# Altium project OpenRex_V1I1.PrjPcb (part 3 of 13)

## Sheet [10] - CPU - GPIO, PWM, LEDS, BUTTONS.SchDoc
size A2; DocumentNumber: 10; SheetNumber: 10; SheetTotal: 31
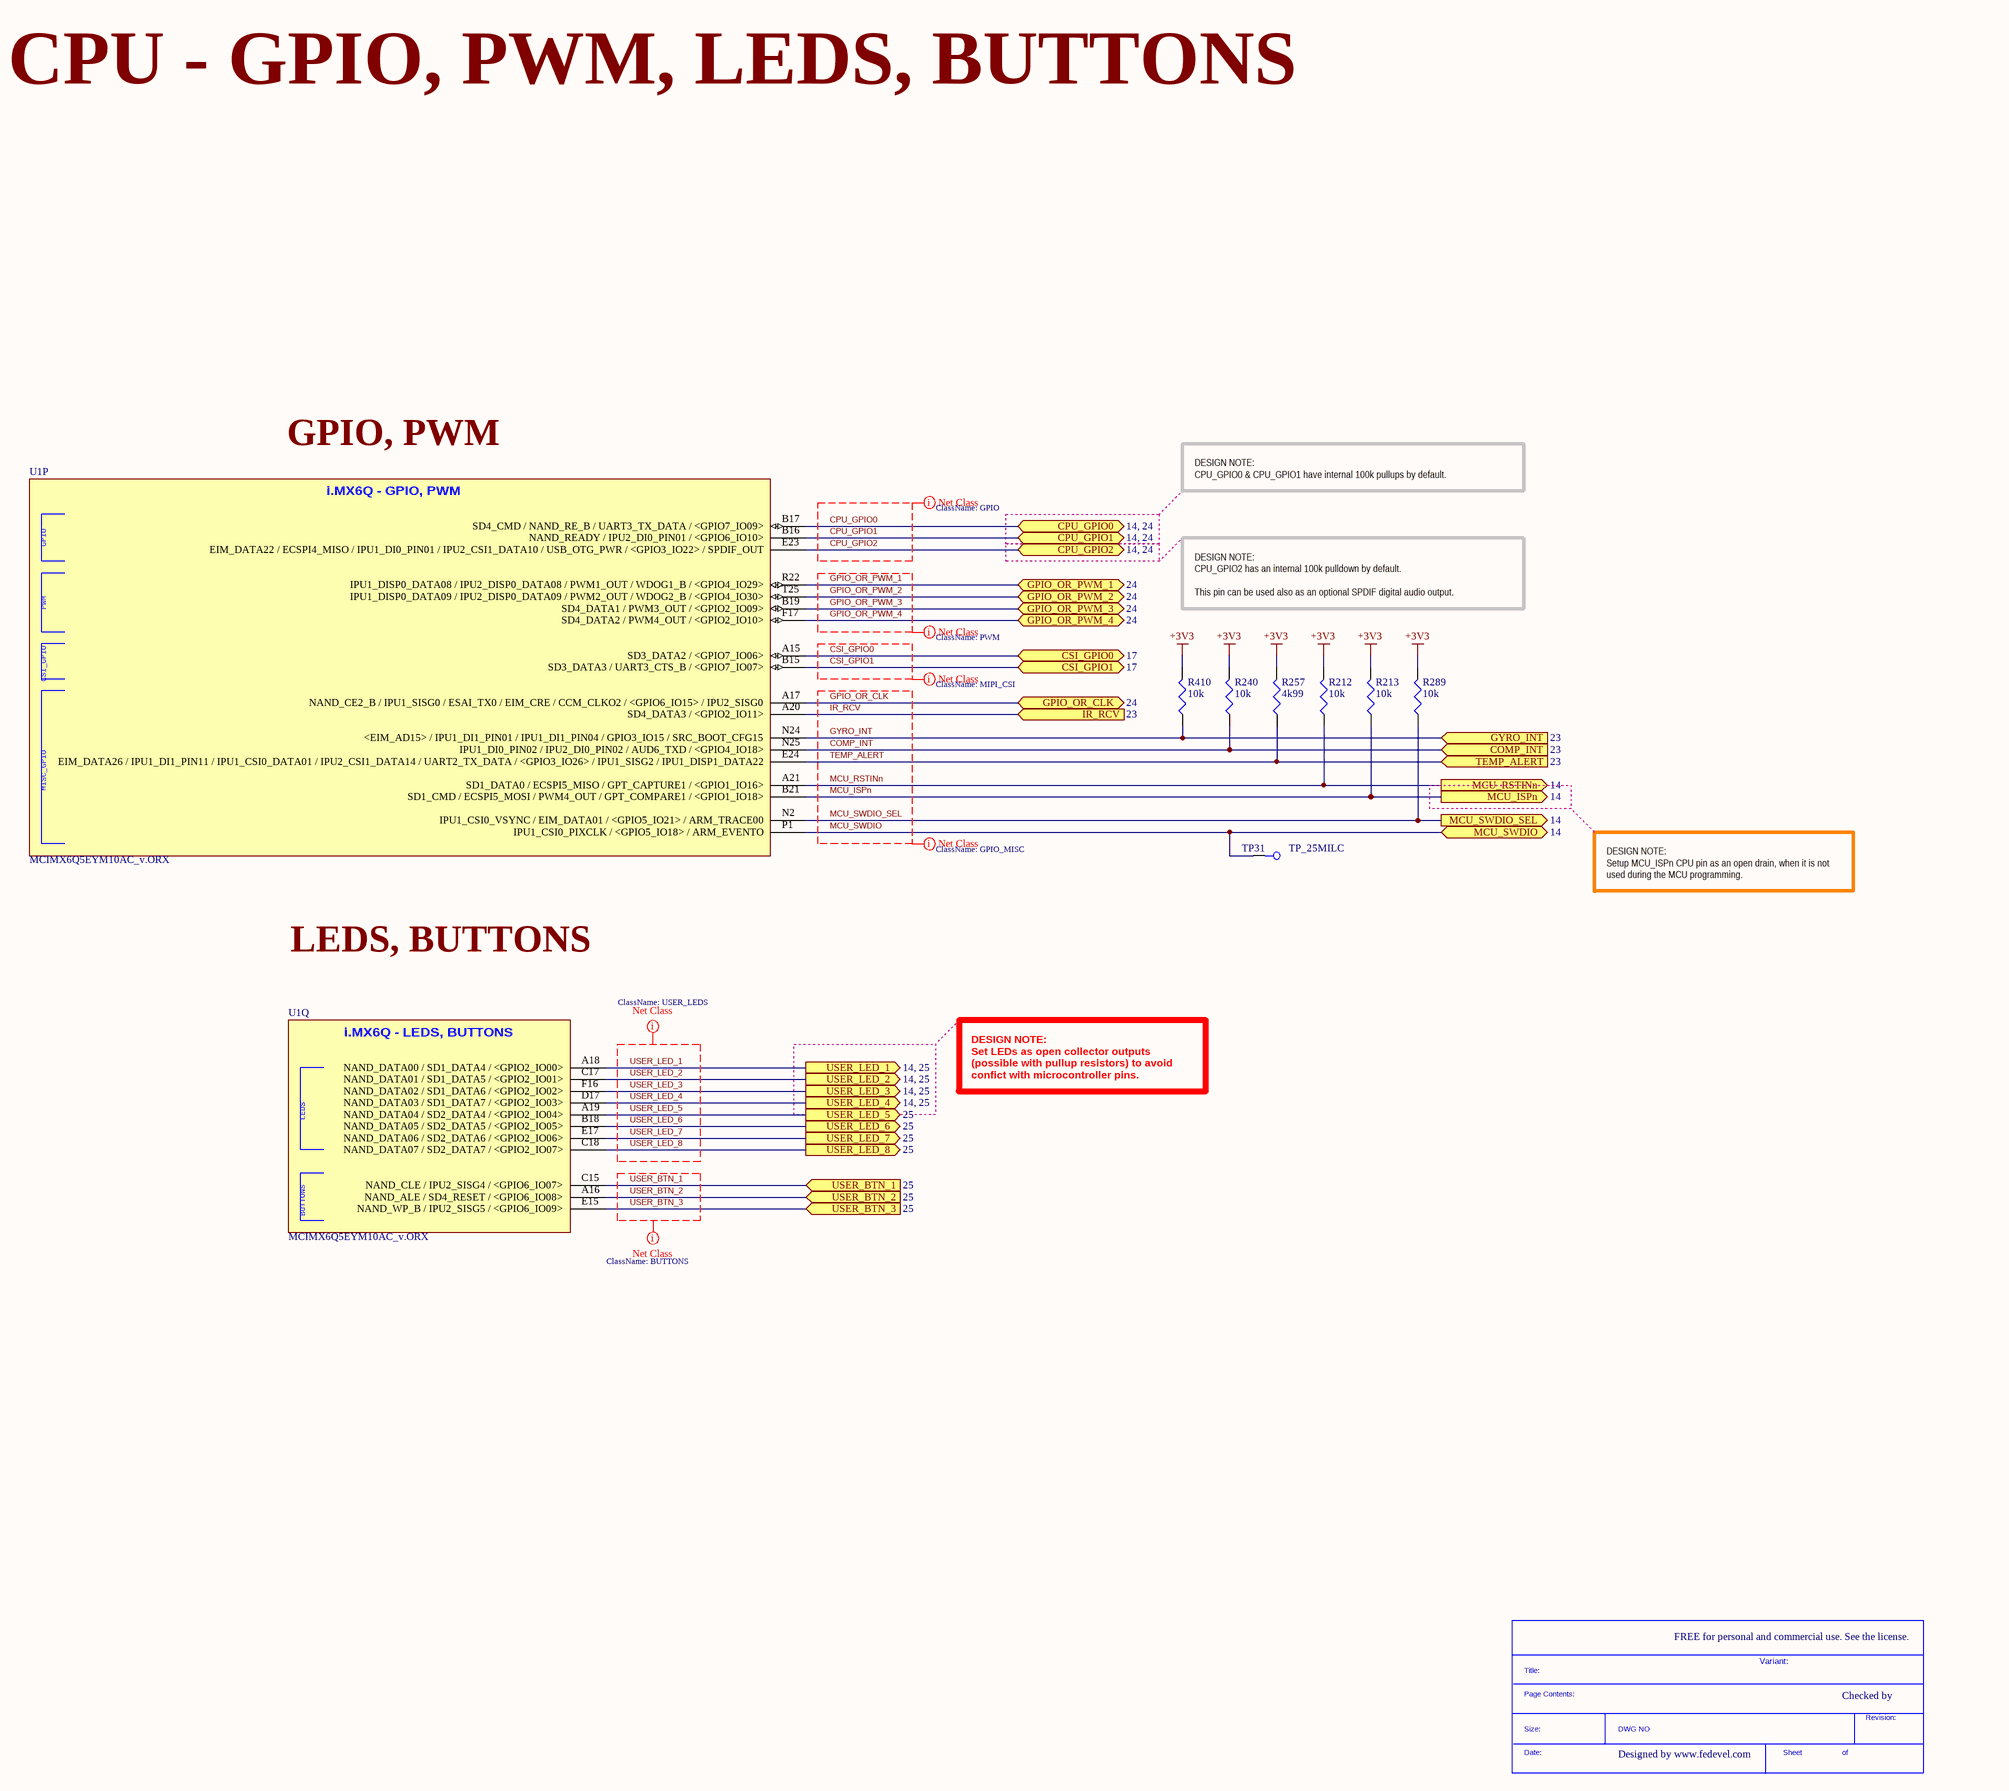
[diagram p12: [10] - CPU - GPIO, PWM, LEDS, BUTTONS.SchDoc]

### Parts
(Parts that share a designator on the sheet are numbered #1, #2 ... from top to bottom, then left to right.)
*#9  SDTitleBlock  (value not drawn)  (graphical)
R212  10k  [R0402]
R213  10k  [R0402]
R240  10k  [R0402]
R257  4k99  [R0402]
R289  10k  [R0402]
R410  10k  [R0402]
TP31  TP_25MILC  [TP_25C]  (no BOM)
U1  MCIMX6Q5EYM10AC_v.ORX  [PBGA624]  (parts P,Q of 21)

### Ports
COMP_INT (in, see 23), CPU_GPIO0 (bidir, see 14, 24), CPU_GPIO1 (bidir, see 14, 24), CPU_GPIO2 (bidir, see 14, 24), CSI_GPIO0 (bidir, see 17), CSI_GPIO1 (bidir, see 17), GPIO_OR_CLK (bidir, see 24), GPIO_OR_PWM_1 (bidir, see 24), GPIO_OR_PWM_2 (bidir, see 24), GPIO_OR_PWM_3 (bidir, see 24), GPIO_OR_PWM_4 (bidir, see 24), GYRO_INT (in, see 23), IR_RCV (in, see 23), MCU_ISPn (out, see 14), MCU_RSTINn (out, see 14), MCU_SWDIO (bidir, see 14), MCU_SWDIO_SEL (out, see 14), TEMP_ALERT (in, see 23), USER_BTN_1 (in, see 25), USER_BTN_2 (in, see 25), USER_BTN_3 (in, see 25), USER_LED_1 (out, see 14, 25), USER_LED_2 (out, see 14, 25), USER_LED_3 (out, see 14, 25), USER_LED_4 (out, see 14, 25), USER_LED_5 (out, see 25), USER_LED_6 (out, see 25), USER_LED_7 (out, see 25), USER_LED_8 (out, see 25)

### Nets
+3V3: R212.2 R213.2 R240.2 R257.2 R289.2 R410.2
COMP_INT: R240.1 U1.N25(IPU1_DI0_PIN02_/_IPU2_DI0_PIN02_/_AUD6_TXD_/_<GPIO4_IO18>) ; port COMP_INT
CPU_GPIO0: U1.B17(SD4_CMD_/_NAND_RE_B_/_UART3_TX_DATA_/_<GPIO7_IO09>) ; port CPU_GPIO0
CPU_GPIO1: U1.B16(NAND_READY_/_IPU2_DI0_PIN01_/_<GPIO6_IO10>) ; port CPU_GPIO1
CPU_GPIO2: U1.E23(EIM_DATA22_/_ECSPI4_MISO_/_IPU1_DI0_PIN01_/_IPU2_CSI1_DATA10_/_USB_OTG_PWR_/_<GPIO3_IO22>_/_SPDIF_OUT) ; port CPU_GPIO2
CSI_GPIO0: U1.A15(SD3_DATA2_/_<GPIO7_IO06>) ; port CSI_GPIO0
CSI_GPIO1: U1.B15(SD3_DATA3_/_UART3_CTS_B_/_<GPIO7_IO07>) ; port CSI_GPIO1
GPIO_OR_CLK: U1.A17(NAND_CE2_B_/_IPU1_SISG0_/_ESAI_TX0_/_EIM_CRE_/_CCM_CLKO2_/_<GPIO6_IO15>_/_IPU2_SISG0) ; port GPIO_OR_CLK
GPIO_OR_PWM_1: U1.R22(IPU1_DISP0_DATA08_/_IPU2_DISP0_DATA08_/_PWM1_OUT_/_WDOG1_B_/_<GPIO4_IO29>) ; port GPIO_OR_PWM_1
GPIO_OR_PWM_2: U1.T25(IPU1_DISP0_DATA09_/_IPU2_DISP0_DATA09_/_PWM2_OUT_/_WDOG2_B_/_<GPIO4_IO30>) ; port GPIO_OR_PWM_2
GPIO_OR_PWM_3: U1.B19(SD4_DATA1_/_PWM3_OUT_/_<GPIO2_IO09>) ; port GPIO_OR_PWM_3
GPIO_OR_PWM_4: U1.F17(SD4_DATA2_/_PWM4_OUT_/_<GPIO2_IO10>) ; port GPIO_OR_PWM_4
GYRO_INT: R410.1 U1.N24(<EIM_AD15>_/_IPU1_DI1_PIN01_/_IPU1_DI1_PIN04_/_GPIO3_IO15_/_SRC_BOOT_CFG15) ; port GYRO_INT
IR_RCV: U1.A20(SD4_DATA3_/_<GPIO2_IO11>) ; port IR_RCV
MCU_ISPn: R213.1 U1.B21(SD1_CMD_/_ECSPI5_MOSI_/_PWM4_OUT_/_GPT_COMPARE1_/_<GPIO1_IO18>) ; port MCU_ISPn
MCU_RSTINn: R212.1 U1.A21(SD1_DATA0_/_ECSPI5_MISO_/_GPT_CAPTURE1_/_<GPIO1_IO16>) ; port MCU_RSTINn
MCU_SWDIO: TP31.1 U1.P1(IPU1_CSI0_PIXCLK_/_<GPIO5_IO18>_/_ARM_EVENTO) ; port MCU_SWDIO
MCU_SWDIO_SEL: R289.1 U1.N2(IPU1_CSI0_VSYNC_/_EIM_DATA01_/_<GPIO5_IO21>_/_ARM_TRACE00) ; port MCU_SWDIO_SEL
TEMP_ALERT: R257.1 U1.E24(EIM_DATA26_/_IPU1_DI1_PIN11_/_IPU1_CSI0_DATA01_/_IPU2_CSI1_DATA14_/_UART2_TX_DATA_/_<GPIO3_IO26>_/_IPU1_SISG2_/_IPU1_DISP1_DATA22) ; port TEMP_ALERT
USER_BTN_1: U1.C15(NAND_CLE_/_IPU2_SISG4_/_<GPIO6_IO07>) ; port USER_BTN_1
USER_BTN_2: U1.A16(NAND_ALE_/_SD4_RESET_/_<GPIO6_IO08>) ; port USER_BTN_2
USER_BTN_3: U1.E15(NAND_WP_B_/_IPU2_SISG5_/_<GPIO6_IO09>) ; port USER_BTN_3
USER_LED_1: U1.A18(NAND_DATA00_/_SD1_DATA4_/_<GPIO2_IO00>) ; port USER_LED_1
USER_LED_2: U1.C17(NAND_DATA01_/_SD1_DATA5_/_<GPIO2_IO01>) ; port USER_LED_2
USER_LED_3: U1.F16(NAND_DATA02_/_SD1_DATA6_/_<GPIO2_IO02>) ; port USER_LED_3
USER_LED_4: U1.D17(NAND_DATA03_/_SD1_DATA7_/_<GPIO2_IO03>) ; port USER_LED_4
USER_LED_5: U1.A19(NAND_DATA04_/_SD2_DATA4_/_<GPIO2_IO04>) ; port USER_LED_5
USER_LED_6: U1.B18(NAND_DATA05_/_SD2_DATA5_/_<GPIO2_IO05>) ; port USER_LED_6
USER_LED_7: U1.E17(NAND_DATA06_/_SD2_DATA6_/_<GPIO2_IO06>) ; port USER_LED_7
USER_LED_8: U1.C18(NAND_DATA07_/_SD2_DATA7_/_<GPIO2_IO07>) ; port USER_LED_8

### Layout directives
net class PWM: GPIO_OR_PWM_1, GPIO_OR_PWM_2, GPIO_OR_PWM_3, GPIO_OR_PWM_4
net class GPIO: CPU_GPIO0, CPU_GPIO1, CPU_GPIO2
net class GPIO_MISC: COMP_INT, GPIO_OR_CLK, GYRO_INT, IR_RCV, MCU_ISPn, MCU_RSTINn, MCU_SWDIO, MCU_SWDIO_SEL, TEMP_ALERT
net class USER_LEDS: USER_LED_1, USER_LED_2, USER_LED_3, USER_LED_4, USER_LED_5, USER_LED_6, USER_LED_7, USER_LED_8
net class BUTTONS: USER_BTN_1, USER_BTN_2, USER_BTN_3
net class MIPI_CSI: CSI_GPIO0, CSI_GPIO1

### Notes on the sheet
- CPU - GPIO, PWM, LEDS, BUTTONS
- GPIO, PWM
- DESIGN NOTE:
  CPU_GPIO0 & CPU_GPIO1 have internal 100k pullups by default.
- DESIGN NOTE:
  CPU_GPIO2 has an internal 100k pulldown by default.
  This pin can be used also as an optional SPDIF digital audio output.
- DESIGN NOTE:
  Setup MCU_ISPn CPU pin as an open drain, when it is not used during the MCU programming.
- LEDS, BUTTONS
- DESIGN NOTE:
  Set LEDs as open collector outputs (possible with pullup resistors) to avoid confict with microcontroller pins.
- FREE for personal and commercial use. See the license.
- Variant:
- Checked by
- Designed by www.fedevel.com
- (in symbol MCIMX6Q5EYM10AC_v.ORX, part P) i.MX6Q - GPIO, PWM; GPIO; PWM; CSI_GPIO; MISC_GPIO
- (in symbol MCIMX6Q5EYM10AC_v.ORX, part Q) i.MX6Q - LEDS, BUTTONS; LEDS; BUTTONS
- (in symbol SDTitleBlock) Title:; Page Contents:; Revision:; Size:; DWG NO; Date:; Sheet; of

### Library data of the parts
R212 R213 R240 R289 R410 = RC0402FR-0710KL: RES 10.0K OHM 1/16W 1% 0402 SMD; Manufacturer: Yageo; Power (Watts): 0.063W, 1/16W; .Checked PCB: used; Temperature Coefficient: ±100ppm/°C; Category: Resistors; Supplier Part Number: 311-10.0KLRCT-ND; Manufacturer Part Number: RC0402FR-0710KL; Package / Case: 0402 (1005 Metric); Price 1k [$]: 0.01421; Resistance (Ohms): 10K; Tolerance: ±1%; Value: 10k; .Checked SCH: used; Supplier: Digikey; Supplier 1: Digi-Key; Supplier Part Number 1: 311-10.0KLRCT-ND; RoHS: RoHS Compliant; Stock 1: 2916495; Pricing 1: 10=0.014, 50=0.0104, 100=0.0079, 250=0.00584, 500=0.00432, 1000=0.00288 (USD); Composition: Thick Film; Features: -; Size / Dimension: 0.039" L x 0.020" W (1.00mm x 0.50mm); Height: 0.016" (0.40mm); Number of Terminations: 2; Packaging: Cut Tape (CT); ComponentLink1URL: http://www.yageo.com/documents/recent/PYu-RC0402_51_RoHS_L_6.pdf; ComponentLink1Description: http://www.yageo.com/documents/recent/PYu-RC0402_51_RoHS_L_6.pdf
R257 = RMCF0402FT4K99: RES TF 4.99K OHM 1% 1/16W 0402; Manufacturer: Stackpole Electronics Inc; Power (Watts): 0.063W, 1/16W; .Checked PCB: used; Temperature Coefficient: ±100ppm/°C; Category: Resistors; Supplier Part Number: RMCF0402FT4K99CT-ND; Manufacturer Part Number: RMCF0402FT4K99; Package / Case: 0402 (1005 Metric); Price 1k [$]: 0.00384; Resistance (Ohms): 4.99K; Tolerance: ±1%; Value: 4k99; .Checked SCH: used; Supplier: Digikey; Supplier 1: Digi-Key; Supplier Part Number 1: RMCF0402FT4K99CT-ND; RoHS: RoHS Compliant; Stock 1: 48509; Pricing 1: 1=0.04, 10=0.025, 50=0.0138, 100=0.0105, 250=0.0078, 500=0.00576, 1000=0.00384 (USD); Composition: Thick Film; Features: -; Size / Dimension: 0.039" L x 0.020" W (1.00mm x 0.50mm); Height: 0.016" (0.40mm); Number of Terminations: 2; Packaging: Cut Tape (CT); ComponentLink1URL: http://www.seielect.com/Catalog/SEI-RMCF.pdf; ComponentLink1Description: http://www.seielect.com/Catalog/SEI-RMCF.pdf
TP31 = TP_25MILC: Test Point 25mil
U1 = MCIMX6Q5EYM10AC_v.ORX: IC MCU 32BIT ARM QUAD 624FCBGA; Manufacturer: Freescale Semiconductor; Core Processor: ARM® Cortex™-A9; Core Size: 32-Bit Quad-Core; Speed: 1.0GHz; Connectivity: CAN, EBI/EMI, ESAI, Ethernet, GPMI, I2C, MMC/SD, PCI, SATA, SPI, UART, USB, USB OTG; Peripherals: DMA, HDMI, I2S/SSI/AC97, MIPI CSI, MIMI DSI, MIPI HIS, PWM, WDT; Number of I /O: 224; Program Memory Type: External Program Memory; RAM Size: 256K x 8; Voltage - Supply (Vcc/Vdd): 0.925 V ~ 1.5 V; Oscillator Type: Internal; .Creator: MM; .Checked PCB: MM, checked by RF; Supplier 1: Digi-Key; Manufacturer Part Number: MCIMX6Q5EYM10AC; RoHS: RoHS Compliant; Category: Integrated Circuits (ICs); Stock 1: 0; Pricing 1: 1=54.98, 10=51.922, 25=48.868, 100=30.5424 (USD); Program Memory Size: -; EEPROM Size: -; Data Converters: -; Operating Temperature: -20°C ~ 105°C; Package / Case: 624-FBGA, FCBGA; Packaging: Tray; ComponentLink1URL: http://cache.freescale.com/files/32bit/doc/data_sheet/IMX6DQCEC.pdf; ComponentLink1Description: http://cache.freescale.com/files/32bit/doc/data_sheet/IMX6DQCEC.pdf; Supplier Part Number 1: MCIMX6Q5EYM10AC-ND

## Sheet [09] - CPU - SD, AUDIO, I2C, CAN.SchDoc
size A2; DocumentNumber: 9; SheetNumber: 9; SheetTotal: 31
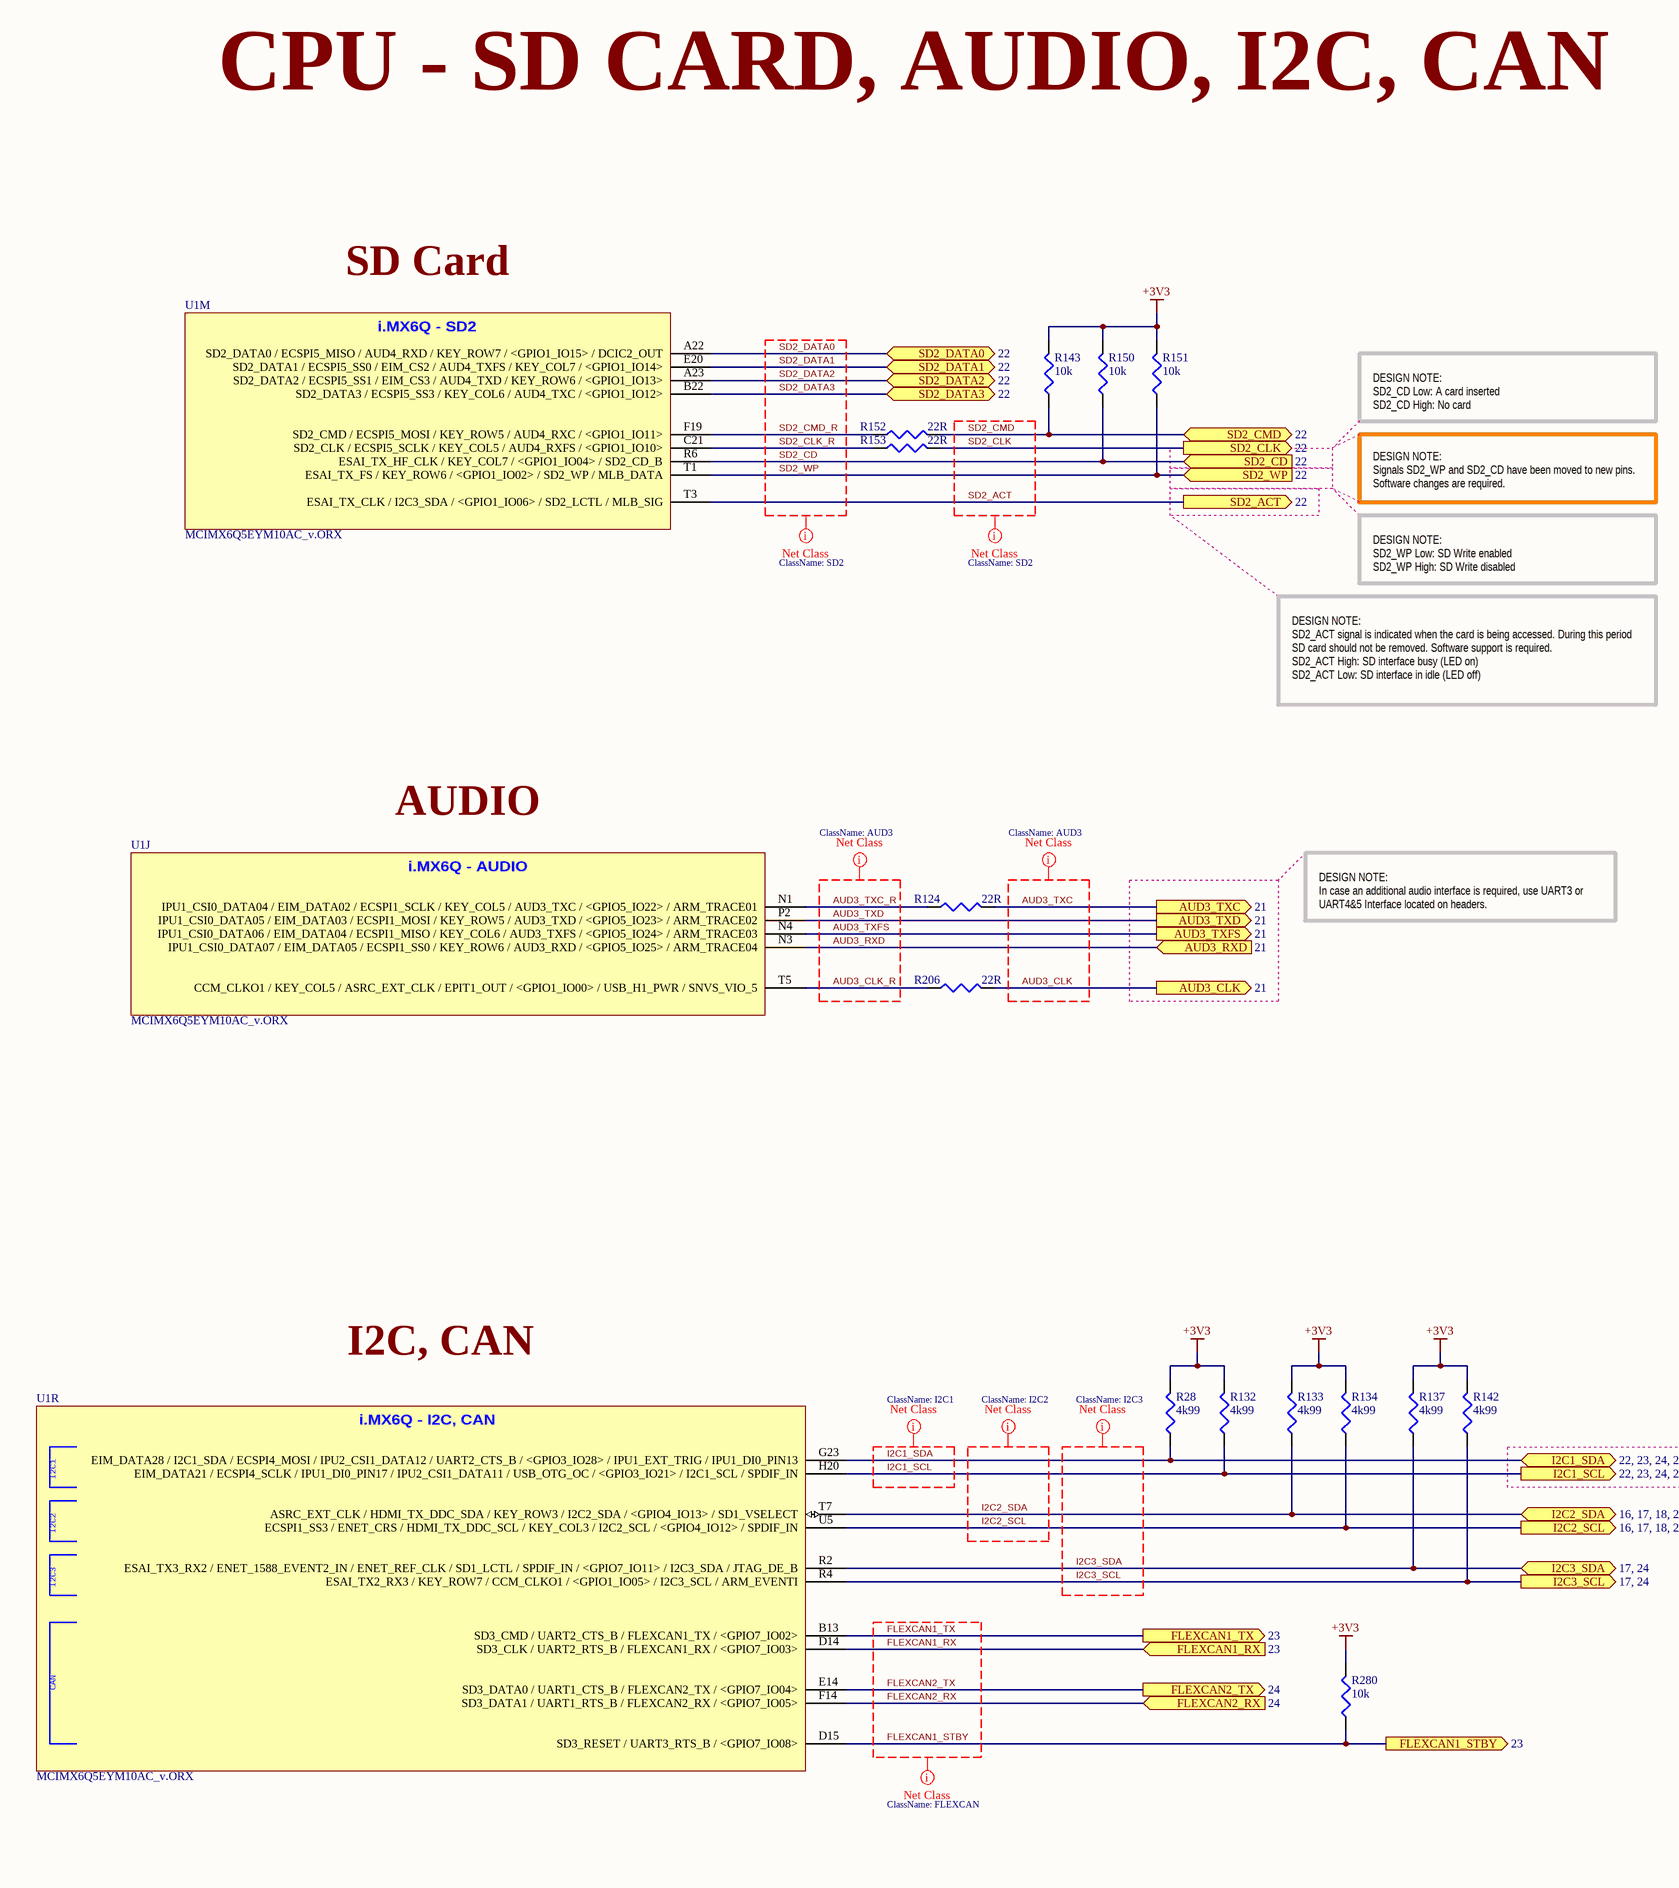
[diagram p13: [09] - CPU - SD, AUDIO, I2C, CAN.SchDoc, left]
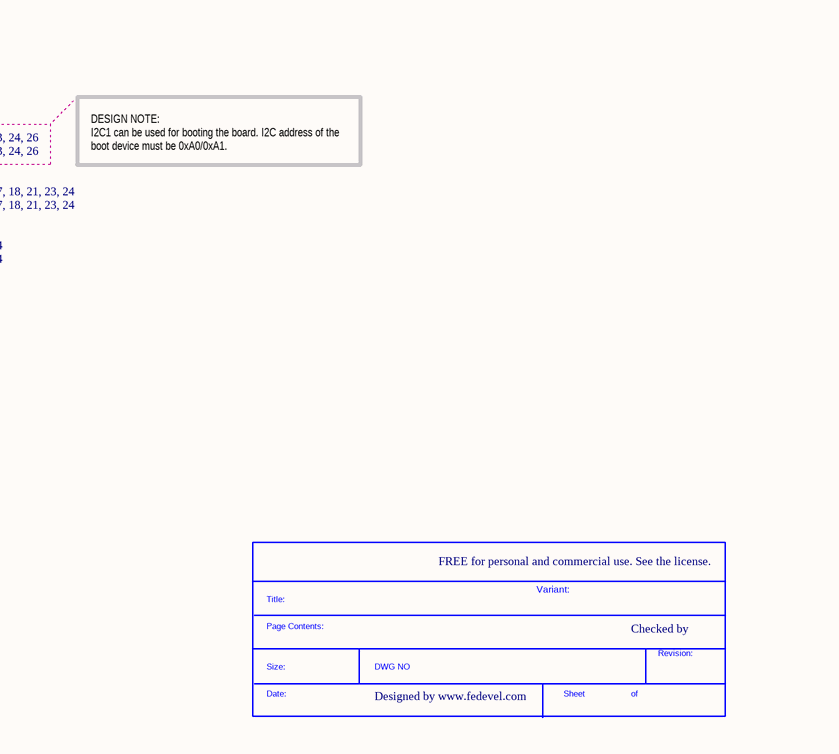
[diagram p14: [09] - CPU - SD, AUDIO, I2C, CAN.SchDoc, right]

### Parts
(Parts that share a designator on the sheet are numbered #1, #2 ... from top to bottom, then left to right.)
*#10  SDTitleBlock  (value not drawn)  (graphical)
R28  4k99  [R0402]
R124  22R  [R0402]
R132  4k99  [R0402]
R133  4k99  [R0402]
R134  4k99  [R0402]
R137  4k99  [R0402]
R142  4k99  [R0402]
R143  10k  [R0402]
R150  10k  [R0402]
R151  10k  [R0402]
R152  22R  [R0402]
R153  22R  [R0402]
R206  22R  [R0402]
R280  10k  [R0402]
U1  MCIMX6Q5EYM10AC_v.ORX  [PBGA624]  (parts J,M,R of 21)

### Ports
AUD3_CLK (out, see 21), AUD3_RXD (in, see 21), AUD3_TXC (out, see 21), AUD3_TXD (out, see 21), AUD3_TXFS (out, see 21), FLEXCAN1_RX (in, see 23), FLEXCAN1_STBY (out, see 23), FLEXCAN1_TX (out, see 23), FLEXCAN2_RX (in, see 24), FLEXCAN2_TX (out, see 24), I2C1_SCL (see 22, 23, 24, 26), I2C1_SDA (bidir, see 22, 23, 24, 26), I2C2_SCL (see 16, 17, 18, 21, 23, 24), I2C2_SDA (bidir, see 16, 17, 18, 21, 23, 24), I2C3_SCL (see 17, 24), I2C3_SDA (bidir, see 17, 24), SD2_ACT (out, see 22), SD2_CD (in, see 22), SD2_CLK (out, see 22), SD2_CMD (bidir, see 22), SD2_DATA0 (bidir, see 22), SD2_DATA1 (bidir, see 22), SD2_DATA2 (bidir, see 22), SD2_DATA3 (bidir, see 22), SD2_WP (in, see 22)

### Nets
+3V3: R28.2 R132.2 R133.2 R134.2 R137.2 R142.2 R143.2 R150.2 R151.2 R280.2
AUD3_CLK: R206.2 ; port AUD3_CLK
AUD3_CLK_R: R206.1 U1.T5(CCM_CLKO1_/_KEY_COL5_/_ASRC_EXT_CLK_/_EPIT1_OUT_/_<GPIO1_IO00>_/_USB_H1_PWR_/_SNVS_VIO_5)
AUD3_RXD: U1.N3(IPU1_CSI0_DATA07_/_EIM_DATA05_/_ECSPI1_SS0_/_KEY_ROW6_/_AUD3_RXD_/_<GPIO5_IO25>_/_ARM_TRACE04) ; port AUD3_RXD
AUD3_TXC: R124.2 ; port AUD3_TXC
AUD3_TXC_R: R124.1 U1.N1(IPU1_CSI0_DATA04_/_EIM_DATA02_/_ECSPI1_SCLK_/_KEY_COL5_/_AUD3_TXC_/_<GPIO5_IO22>_/_ARM_TRACE01)
AUD3_TXD: U1.P2(IPU1_CSI0_DATA05_/_EIM_DATA03_/_ECSPI1_MOSI_/_KEY_ROW5_/_AUD3_TXD_/_<GPIO5_IO23>_/_ARM_TRACE02) ; port AUD3_TXD
AUD3_TXFS: U1.N4(IPU1_CSI0_DATA06_/_EIM_DATA04_/_ECSPI1_MISO_/_KEY_COL6_/_AUD3_TXFS_/_<GPIO5_IO24>_/_ARM_TRACE03) ; port AUD3_TXFS
FLEXCAN1_RX: U1.D14(SD3_CLK_/_UART2_RTS_B_/_FLEXCAN1_RX_/_<GPIO7_IO03>) ; port FLEXCAN1_RX
FLEXCAN1_STBY: R280.1 U1.D15(SD3_RESET_/_UART3_RTS_B_/_<GPIO7_IO08>) ; port FLEXCAN1_STBY
FLEXCAN1_TX: U1.B13(SD3_CMD_/_UART2_CTS_B_/_FLEXCAN1_TX_/_<GPIO7_IO02>) ; port FLEXCAN1_TX
FLEXCAN2_RX: U1.F14(SD3_DATA1_/_UART1_RTS_B_/_FLEXCAN2_RX_/_<GPIO7_IO05>) ; port FLEXCAN2_RX
FLEXCAN2_TX: U1.E14(SD3_DATA0_/_UART1_CTS_B_/_FLEXCAN2_TX_/_<GPIO7_IO04>) ; port FLEXCAN2_TX
I2C1_SCL: R132.1 U1.H20(EIM_DATA21_/_ECSPI4_SCLK_/_IPU1_DI0_PIN17_/_IPU2_CSI1_DATA11_/_USB_OTG_OC_/_<GPIO3_IO21>_/_I2C1_SCL_/_SPDIF_IN) ; port I2C1_SCL
I2C1_SDA: R28.1 U1.G23(EIM_DATA28_/_I2C1_SDA_/_ECSPI4_MOSI_/_IPU2_CSI1_DATA12_/_UART2_CTS_B_/_<GPIO3_IO28>_/_IPU1_EXT_TRIG_/_IPU1_DI0_PIN13) ; port I2C1_SDA
I2C2_SCL: R134.1 U1.U5(ECSPI1_SS3_/_ENET_CRS_/_HDMI_TX_DDC_SCL_/_KEY_COL3_/_I2C2_SCL_/_<GPIO4_IO12>_/_SPDIF_IN) ; port I2C2_SCL
I2C2_SDA: R133.1 U1.T7(ASRC_EXT_CLK_/_HDMI_TX_DDC_SDA_/_KEY_ROW3_/_I2C2_SDA_/_<GPIO4_IO13>_/_SD1_VSELECT) ; port I2C2_SDA
I2C3_SCL: R142.1 U1.R4(ESAI_TX2_RX3_/_KEY_ROW7_/_CCM_CLKO1_/_<GPIO1_IO05>_/_I2C3_SCL_/_ARM_EVENTI) ; port I2C3_SCL
I2C3_SDA: R137.1 U1.R2(ESAI_TX3_RX2_/_ENET_1588_EVENT2_IN_/_ENET_REF_CLK_/_SD1_LCTL_/_SPDIF_IN_/_<GPIO7_IO11>_/_I2C3_SDA_/_JTAG_DE_B) ; port I2C3_SDA
SD2_ACT: U1.T3(ESAI_TX_CLK_/_I2C3_SDA_/_<GPIO1_IO06>_/_SD2_LCTL_/_MLB_SIG) ; port SD2_ACT
SD2_CD: R150.1 U1.R6(ESAI_TX_HF_CLK_/_KEY_COL7_/_<GPIO1_IO04>_/_SD2_CD_B) ; port SD2_CD
SD2_CLK: R153.2 ; port SD2_CLK
SD2_CLK_R: R153.1 U1.C21(SD2_CLK_/_ECSPI5_SCLK_/_KEY_COL5_/_AUD4_RXFS_/_<GPIO1_IO10>)
SD2_CMD: R143.1 R152.2 ; port SD2_CMD
SD2_CMD_R: R152.1 U1.F19(SD2_CMD_/_ECSPI5_MOSI_/_KEY_ROW5_/_AUD4_RXC_/_<GPIO1_IO11>)
SD2_DATA0: U1.A22(SD2_DATA0_/_ECSPI5_MISO_/_AUD4_RXD_/_KEY_ROW7_/_<GPIO1_IO15>_/_DCIC2_OUT) ; port SD2_DATA0
SD2_DATA1: U1.E20(SD2_DATA1_/_ECSPI5_SS0_/_EIM_CS2_/_AUD4_TXFS_/_KEY_COL7_/_<GPIO1_IO14>) ; port SD2_DATA1
SD2_DATA2: U1.A23(SD2_DATA2_/_ECSPI5_SS1_/_EIM_CS3_/_AUD4_TXD_/_KEY_ROW6_/_<GPIO1_IO13>) ; port SD2_DATA2
SD2_DATA3: U1.B22(SD2_DATA3_/_ECSPI5_SS3_/_KEY_COL6_/_AUD4_TXC_/_<GPIO1_IO12>) ; port SD2_DATA3
SD2_WP: R151.1 U1.T1(ESAI_TX_FS_/_KEY_ROW6_/_<GPIO1_IO02>_/_SD2_WP_/_MLB_DATA) ; port SD2_WP

### Layout directives
net class AUD3: AUD3_CLK, AUD3_CLK_R, AUD3_RXD, AUD3_TXC, AUD3_TXC_R, AUD3_TXD, AUD3_TXFS
net class FLEXCAN: FLEXCAN1_RX, FLEXCAN1_STBY, FLEXCAN1_TX, FLEXCAN2_RX, FLEXCAN2_TX
net class I2C1: I2C1_SCL, I2C1_SDA
net class I2C2: I2C2_SCL, I2C2_SDA
net class I2C3: I2C3_SCL, I2C3_SDA
net class SD2: SD2_ACT, SD2_CD, SD2_CLK, SD2_CLK_R, SD2_CMD, SD2_CMD_R, SD2_DATA0, SD2_DATA1, SD2_DATA2, SD2_DATA3, SD2_WP

### Notes on the sheet
- CPU - SD CARD, AUDIO, I2C, CAN
- SD Card
- DESIGN NOTE:
  SD2_CD Low: A card inserted
  SD2_CD High: No card
- DESIGN NOTE:
  Signals SD2_WP and SD2_CD have been moved to new pins. Software changes are required.
- DESIGN NOTE:
  SD2_WP Low: SD Write enabled
  SD2_WP High: SD Write disabled
- DESIGN NOTE:
  SD2_ACT signal is indicated when the card is being accessed. During this period SD card should not be removed. Software support is required.
  SD2_ACT High: SD interface busy (LED on)
  SD2_ACT Low: SD interface in idle (LED off)
- AUDIO
- DESIGN NOTE:
  In case an additional audio interface is required, use UART3 or UART4&5 Interface located on headers.
- I2C, CAN
- DESIGN NOTE:
  I2C1 can be used for booting the board. I2C address of the boot device must be 0xA0/0xA1.
- FREE for personal and commercial use. See the license.
- Variant:
- Checked by
- Designed by www.fedevel.com
- (in symbol MCIMX6Q5EYM10AC_v.ORX, part J) i.MX6Q - AUDIO
- (in symbol MCIMX6Q5EYM10AC_v.ORX, part M) i.MX6Q - SD2
- (in symbol MCIMX6Q5EYM10AC_v.ORX, part R) i.MX6Q - I2C, CAN; I2C1; I2C2; I2C3; CAN
- (in symbol SDTitleBlock) Title:; Page Contents:; Revision:; Size:; DWG NO; Date:; Sheet; of

### Library data of the parts
R28 R132-R134 R137 R142 = RMCF0402FT4K99: as R257 on sheet [10] - CPU - GPIO, PWM, LEDS, BUTTONS; Category: Resistors; Supplier Part Number: RMCF0402FT4K99CT-ND; Manufacturer Part Number: RMCF0402FT4K99; Package / Case: 0402 (1005 Metric); Price 1k [$]: 0.00384; Resistance (Ohms): 4.99K; Tolerance: ±1%; Value: 4k99; .Checked SCH: used; Supplier: Digikey; Supplier 1: Digi-Key; Supplier Part Number 1: RMCF0402FT4K99CT-ND; RoHS: RoHS Compliant; Stock 1: 48509; Pricing 1: 1=0.04, 10=0.025, 50=0.0138, 100=0.0105, 250=0.0078, 500=0.00576, 1000=0.00384 (USD); Composition: Thick Film; Features: -; Size / Dimension: 0.039" L x 0.020" W (1.00mm x 0.50mm); Height: 0.016" (0.40mm); Number of Terminations: 2; Packaging: Cut Tape (CT); ComponentLink1URL: http://www.seielect.com/Catalog/SEI-RMCF.pdf; ComponentLink1Description: http://www.seielect.com/Catalog/SEI-RMCF.pdf
R124 R152 R153 R206 = RC0402FR-0722RL: RES 22.0 OHM 1/16W 1% 0402 SMD; Manufacturer: Yageo; Resistance (Ohms): 22; Power (Watts): 0.063W, 1/16W; .Checked PCB: used; Temperature Coefficient: ±100ppm/°C; Category: Resistors; Supplier Part Number: 311-22.0LRCT-ND; Manufacturer Part Number: RC0402FR-0722RL; Package / Case: 0402 (1005 Metric); Price 1k [$]: 0.01421; Tolerance: ±1%; Value: 22R; .Checked SCH: used; Supplier: Digikey; Supplier 1: Digi-Key; Supplier Part Number 1: 311-22.0LRCT-ND; RoHS: RoHS Compliant; Stock 1: 943800; Pricing 1: 10=0.014, 50=0.0104, 100=0.0079, 250=0.00584, 500=0.00432, 1000=0.00288 (USD); Composition: Thick Film; Features: -; Size / Dimension: 0.039" L x 0.020" W (1.00mm x 0.50mm); Height: 0.016" (0.40mm); Number of Terminations: 2; Packaging: Cut Tape (CT); ComponentLink1URL: http://www.yageo.com/documents/recent/PYu-RC0402_51_RoHS_L_6.pdf; ComponentLink1Description: http://www.yageo.com/documents/recent/PYu-RC0402_51_RoHS_L_6.pdf
R143 R150 R151 R280 = RC0402FR-0710KL: as R212 on sheet [10] - CPU - GPIO, PWM, LEDS, BUTTONS; Category: Resistors; Supplier Part Number: 311-10.0KLRCT-ND; Manufacturer Part Number: RC0402FR-0710KL; Package / Case: 0402 (1005 Metric); Price 1k [$]: 0.01421; Resistance (Ohms): 10K; Tolerance: ±1%; Value: 10k; .Checked SCH: used; Supplier: Digikey; Supplier 1: Digi-Key; Supplier Part Number 1: 311-10.0KLRCT-ND; RoHS: RoHS Compliant; Stock 1: 2916495; Pricing 1: 10=0.014, 50=0.0104, 100=0.0079, 250=0.00584, 500=0.00432, 1000=0.00288 (USD); Composition: Thick Film; Features: -; Size / Dimension: 0.039" L x 0.020" W (1.00mm x 0.50mm); Height: 0.016" (0.40mm); Number of Terminations: 2; Packaging: Cut Tape (CT); ComponentLink1URL: http://www.yageo.com/documents/recent/PYu-RC0402_51_RoHS_L_6.pdf; ComponentLink1Description: http://www.yageo.com/documents/recent/PYu-RC0402_51_RoHS_L_6.pdf
U1 = MCIMX6Q5EYM10AC_v.ORX: as U1 on sheet [10] - CPU - GPIO, PWM, LEDS, BUTTONS; Supplier 1: Digi-Key; Manufacturer Part Number: MCIMX6Q5EYM10AC; RoHS: RoHS Compliant; Category: Integrated Circuits (ICs); Stock 1: 0; Pricing 1: 1=54.98, 10=51.922, 25=48.868, 100=30.5424 (USD); Program Memory Size: -; EEPROM Size: -; Data Converters: -; Operating Temperature: -20°C ~ 105°C; Package / Case: 624-FBGA, FCBGA; Packaging: Tray; ComponentLink1URL: http://cache.freescale.com/files/32bit/doc/data_sheet/IMX6DQCEC.pdf; ComponentLink1Description: http://cache.freescale.com/files/32bit/doc/data_sheet/IMX6DQCEC.pdf; Supplier Part Number 1: MCIMX6Q5EYM10AC-ND

## Sheet [11] - CPU - JTAG, CONTROL.SchDoc
size A2; DocumentNumber: 11; SheetNumber: 11; SheetTotal: 31
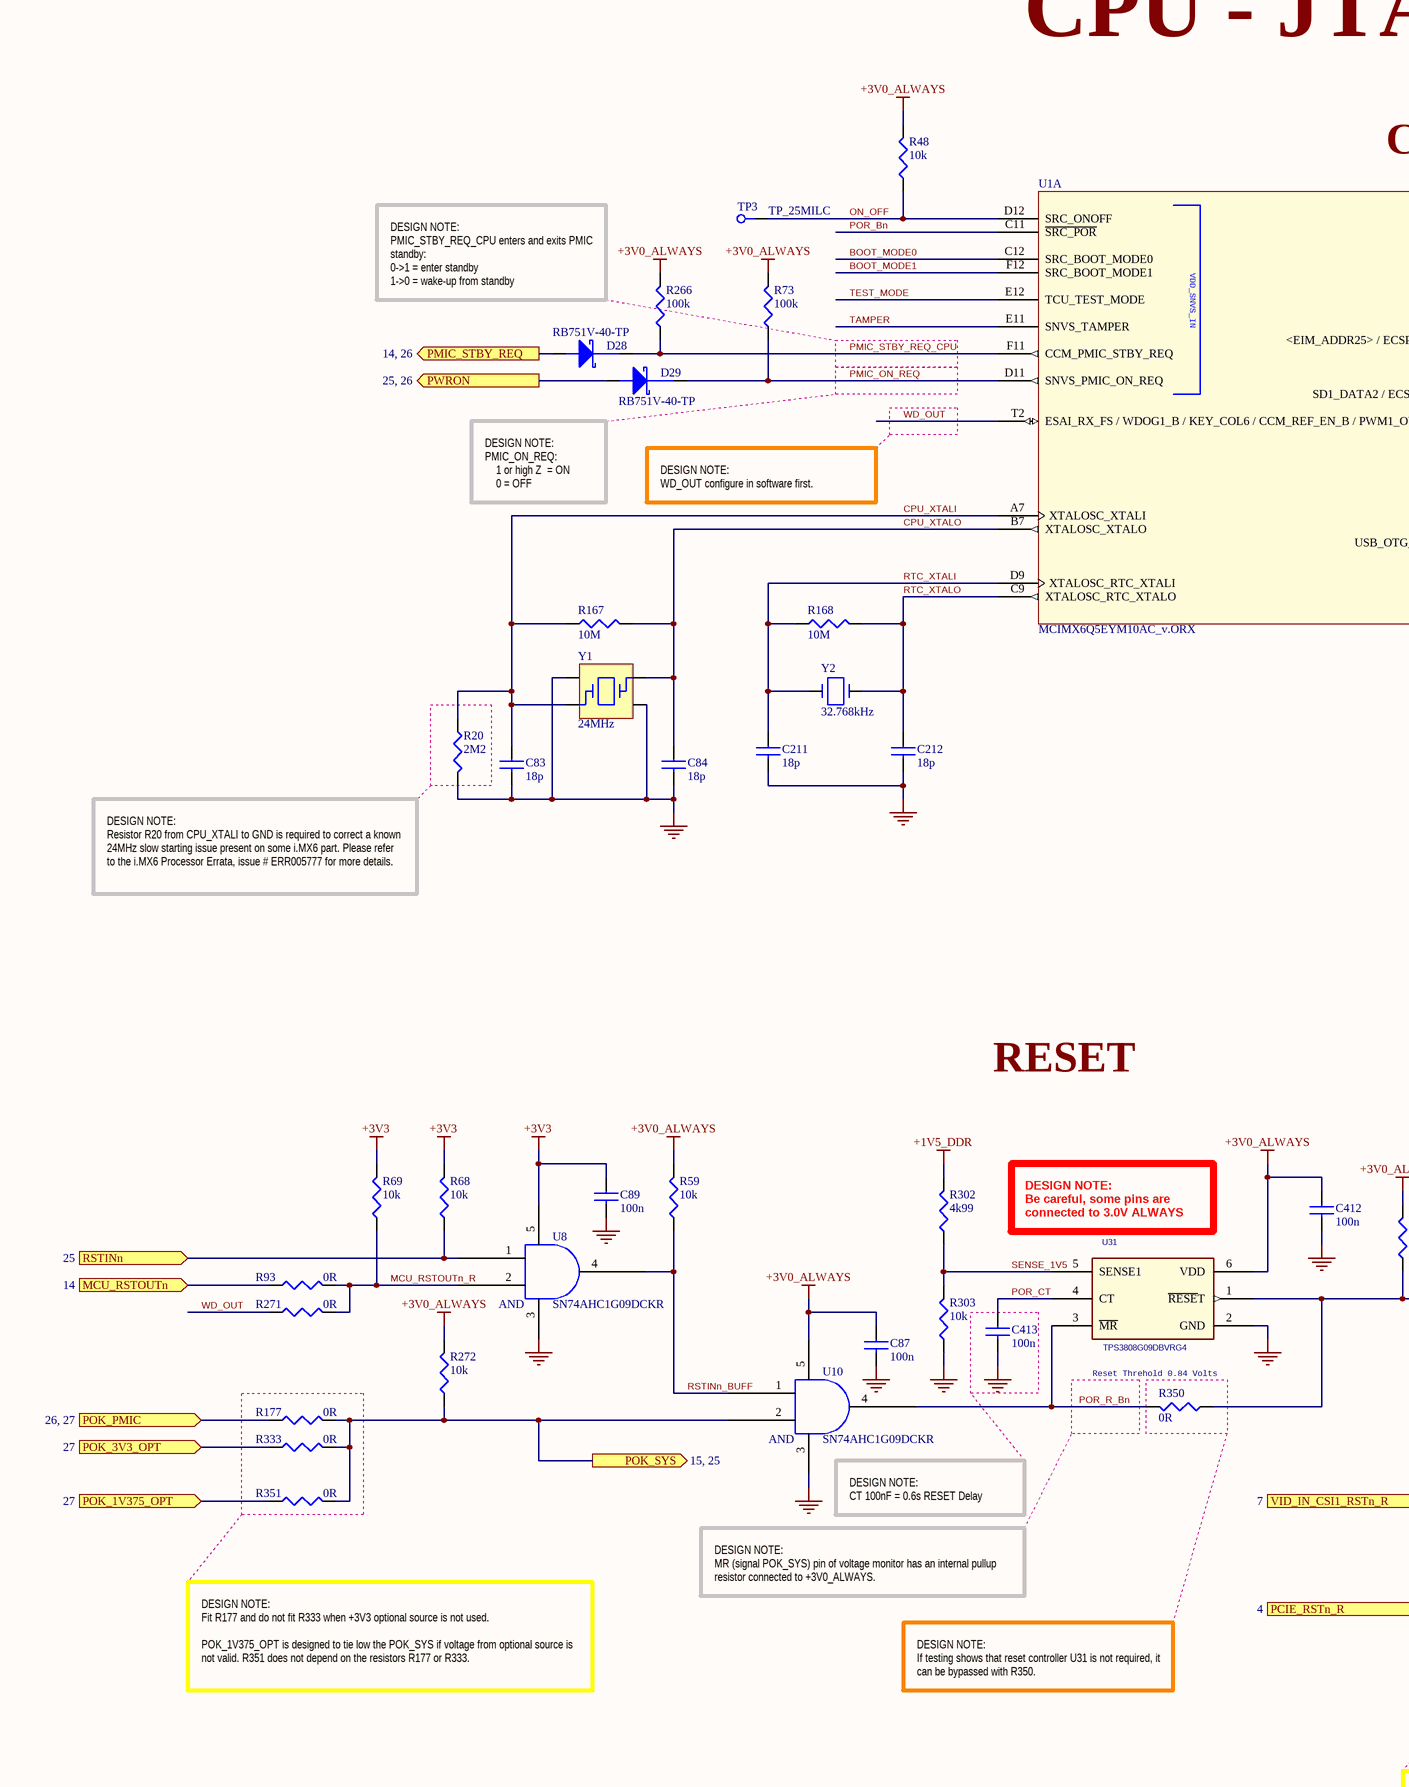
[diagram p15: [11] - CPU - JTAG, CONTROL.SchDoc, left]
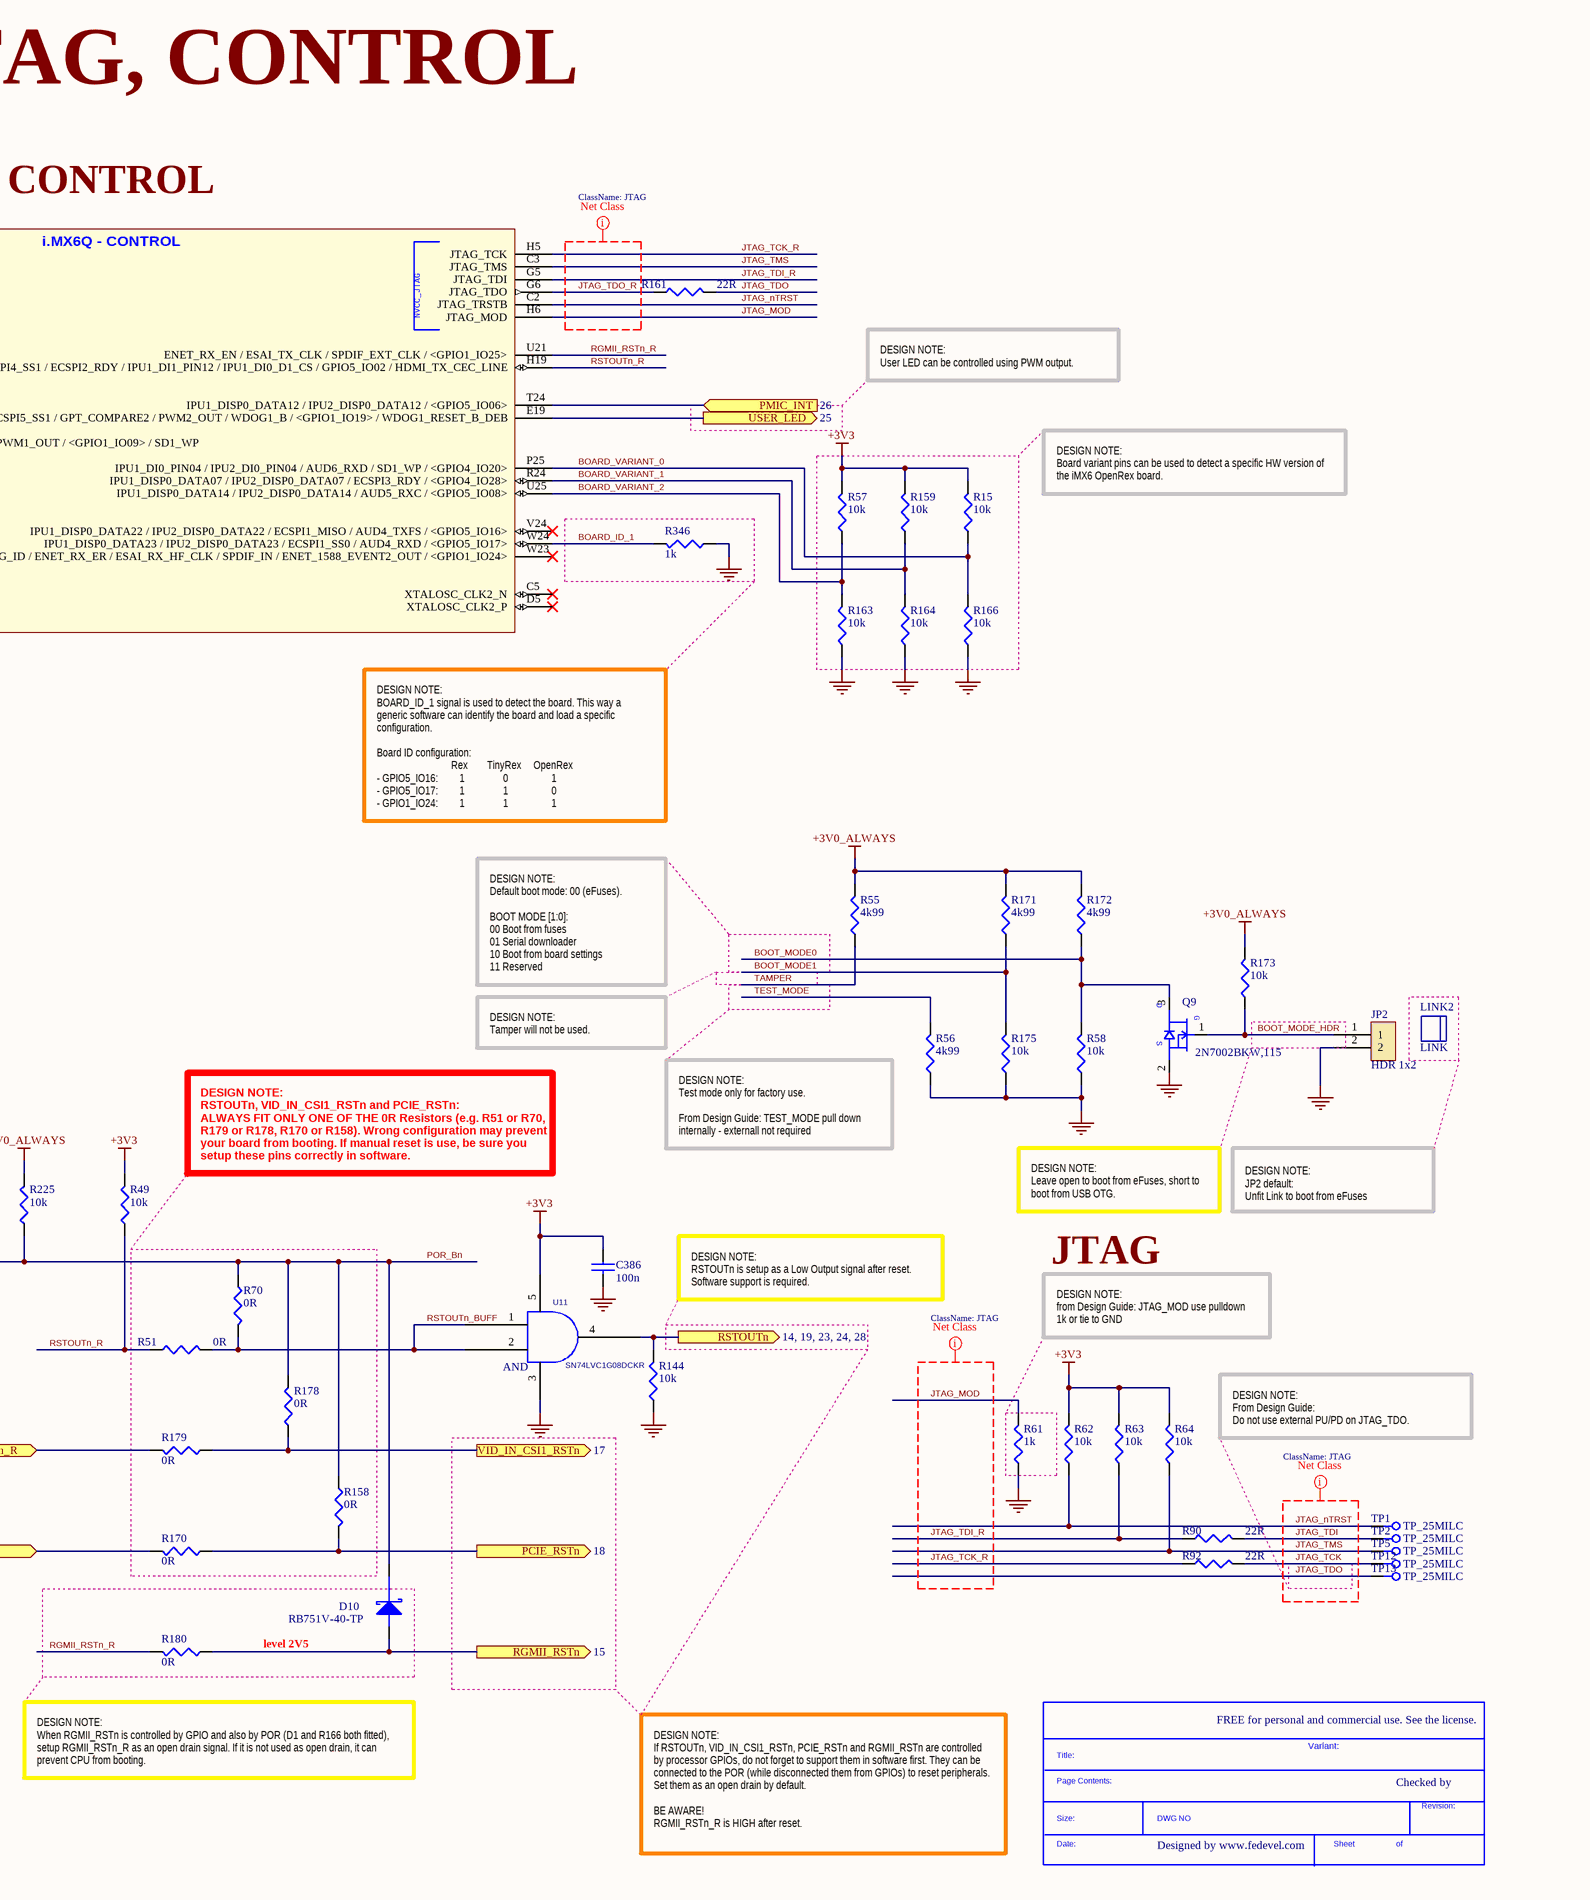
[diagram p16: [11] - CPU - JTAG, CONTROL.SchDoc, right]

### Parts
(Parts that share a designator on the sheet are numbered #1, #2 ... from top to bottom, then left to right.)
*#11  SDTitleBlock  (value not drawn)  (graphical)
C83  18p  [C0402]
C84  18p  [C0402]
C87  100n  [C0402]
C89  100n  [C0402]
C211  18p  [C0201]
C212  18p  [C0201]
C386  100n  [C0402]
C412  100n  [C0402]
C413  100n  [C0402]
D10  RB751V-40-TP  [SOD323]
D28  RB751V-40-TP  [SOD323]
D29  RB751V-40-TP  [SOD323]
JP2  HDR 1x2  [HDR_1x2_2.54MM]
LINK2  LINK  (mechanical)
Q9  2N7002BKW,115  [SC70_SOT323]
R15  10k  [R0402]
R20  2M2  [R0402]
R48  10k  [R0402]
R49  10k  [R0402]
R51  0R  [R0402]
R55  4k99  [R0201]
R56  4k99  [R0201]
R57  10k  [R0402]
R58  10k  [R0402]
R59  10k  [R0402]
R61  1k  [R0201]
R62  10k  [R0402]
R63  10k  [R0402]
R64  10k  [R0402]
R68  10k  [R0402]
R69  10k  [R0402]
R70  0R  [R0402]
R73  100k  [R0402]
R90  22R  [R0402]
R92  22R  [R0402]
R93  0R  [R0402]
R144  10k  [R0402]
R158  0R  [R0402]
R159  10k  [R0402]
R161  22R  [R0402]
R163  10k  [R0402]
R164  10k  [R0402]
R166  10k  [R0402]
R167  10M  [R0402]
R168  10M  [R0201]
R170  0R  [R0402]
R171  4k99  [R0402]
R172  4k99  [R0402]
R173  10k  [R0402]
R175  10k  [R0402]
R177  0R  [R0402]
R178  0R  [R0402]
R179  0R  [R0402]
R180  0R  [R0402]
R225  10k  [R0402]
R266  100k  [R0402]
R271  0R  [R0402]
R272  10k  [R0402]
R302  4k99  [R0402]
R303  10k  [R0402]
R333  0R  [R0402]
R346  1k  [R0402]
R350  0R  [R0402]
R351  0R  [R0402]
TP1  TP_25MILC  [TP_25C]  (no BOM)
TP2  TP_25MILC  [TP_25C]  (no BOM)
TP3  TP_25MILC  [TP_25C]  (no BOM)
TP5  TP_25MILC  [TP_25C]  (no BOM)
TP12  TP_25MILC  [TP_25C]  (no BOM)
TP13  TP_25MILC  [TP_25C]  (no BOM)
U1  MCIMX6Q5EYM10AC_v.ORX  [PBGA624]  (part A of 21)
U8  SN74AHC1G09DCKR  [SC70_5]
U10  SN74AHC1G09DCKR  [SC70_5]
U11  SN74LVC1G08DCKR  [SC70_5]
U31  TPS3808G09DBVRG4  [DBV_SOT_23_6]
Y1  24MHz  [ABM8]
Y2  32.768kHz  [ABS06]

### Blocks framed on the sheet
level 2V5: D10 R180

### Ports
MCU_RSTOUTn (in, see 14), PCIE_RSTn (out, see 18), PCIE_RSTn_R (in, see 4), PMIC_INT (in, see 26), PMIC_STBY_REQ (out, see 14, 26), POK_1V375_OPT (in, see 27), POK_3V3_OPT (in, see 27), POK_PMIC (see 26, 27), POK_SYS (see 15, 25), PWRON (out, see 25, 26), RGMII_RSTn (out, see 15), RSTINn (in, see 25), RSTOUTn (see 14, 19, 23, 24, 28), USER_LED (out, see 25), VID_IN_CSI1_RSTn (out, see 17), VID_IN_CSI1_RSTn_R (in, see 7)

### Nets
+1V5_DDR: R302.2
+3V0_ALWAYS: C87.1 C412.1 R48.2 R55.2 R59.2 R73.2 R171.2 R172.2 R173.2 R225.2 R266.2 R272.2 U10.5(VCC) U31.6(VDD)
+3V3: C89.1 C386.1 R15.2 R49.2 R57.2 R62.2 R63.2 R64.2 R68.2 R69.2 R159.2 U8.5(VCC) U11.5(VCC)
GND: C83.2 C84.2 C87.2 C89.2 C211.2 C212.2 C386.2 C412.2 C413.2 JP2.2 Q9.2(SOURCE) R20.2 R56.1 R58.1 R61.1 R144.1 R163.1 R164.1 R166.1 R175.1 R303.1 R346.1 U8.3(GND) U10.3(GND) U11.3(GND) U31.2(GND) Y1.2 Y1.4
BOARD_ID_1: R346.2 U1.W24(IPU1_DISP0_DATA23_/_IPU2_DISP0_DATA23_/_ECSPI1_SS0_/_AUD4_RXD_/_<GPIO5_IO17>)
BOARD_VARIANT_0: R15.1 R166.2 U1.P25(IPU1_DI0_PIN04_/_IPU2_DI0_PIN04_/_AUD6_RXD_/_SD1_WP_/_<GPIO4_IO20>)
BOARD_VARIANT_1: R159.1 R164.2 U1.R24(IPU1_DISP0_DATA07_/_IPU2_DISP0_DATA07_/_ECSPI3_RDY_/_<GPIO4_IO28>)
BOARD_VARIANT_2: R57.1 R163.2 U1.U25(IPU1_DISP0_DATA14_/_IPU2_DISP0_DATA14_/_AUD5_RXC_/_<GPIO5_IO08>)
BOOT_MODE0: Q9.3(DRAIN) R58.2 R172.1 U1.C12(SRC_BOOT_MODE0)
BOOT_MODE1: R171.1 R175.2 U1.F12(SRC_BOOT_MODE1)
BOOT_MODE_HDR: JP2.1 Q9.1(GATE) R173.1
CPU_XTALI: C83.1 R20.1 R167.1 U1.A7(XTALOSC_XTALI) Y1.3
CPU_XTALO: C84.1 R167.2 U1.B7(XTALOSC_XTALO) Y1.1
JTAG_MOD: R61.2 U1.H6(JTAG_MOD)
JTAG_nTRST: R62.1 TP1.1 U1.C2(JTAG_TRSTB)
JTAG_TCK: R92.2 TP12.1
JTAG_TCK_R: R92.1 U1.H5(JTAG_TCK)
JTAG_TDI: R90.2 TP2.1
JTAG_TDI_R: R63.1 R90.1 U1.G5(JTAG_TDI)
JTAG_TDO: R161.2 TP13.1
JTAG_TDO_R: R161.1 U1.G6(JTAG_TDO)
JTAG_TMS: R64.1 TP5.1 U1.C3(JTAG_TMS)
MCU_RSTOUTn: R93.1 ; port MCU_RSTOUTn
MCU_RSTOUTn_R: R69.1 R93.2 R271.2 U8.2(B)
ON_OFF: R48.1 TP3.1 U1.D12(SRC_ONOFF)
PCIE_RSTn: R158.2 R170.1 ; port PCIE_RSTn
PCIE_RSTn_R: R170.2 ; port PCIE_RSTn_R
PMIC_INT: U1.T24(IPU1_DISP0_DATA12_/_IPU2_DISP0_DATA12_/_<GPIO5_IO06>) ; port PMIC_INT
PMIC_ON_REQ: D29.1(cathode) R73.1 U1.D11(SNVS_PMIC_ON_REQ)
PMIC_STBY_REQ: D28.2(ANODE) ; port PMIC_STBY_REQ
PMIC_STBY_REQ_CPU: D28.1(cathode) R266.1 U1.F11(CCM_PMIC_STBY_REQ)
POK_1V375_OPT: R351.1 ; port POK_1V375_OPT
POK_3V3_OPT: R333.1 ; port POK_3V3_OPT
POK_PMIC: R177.1 ; port POK_PMIC
POK_SYS: R177.2 R272.1 R333.2 R351.2 U10.2(B) ; port POK_SYS
POR_Bn: D10.1(cathode) R70.1 R158.1 R178.2 R225.1 R350.1 U1.C11(~{SRC_POR}) U31.1(~{RESE}T)
POR_CT: C413.1 U31.4(CT)
POR_R_Bn: R350.2 U10.4(Y) U31.3(~{MR})
PWRON: D29.2(ANODE) ; port PWRON
RGMII_RSTn: D10.2(ANODE) R180.1 ; port RGMII_RSTn
RGMII_RSTn_R: R180.2 U1.U21(ENET_RX_EN_/_ESAI_TX_CLK_/_SPDIF_EXT_CLK_/_<GPIO1_IO25>)
RSTINn: R68.1 U8.1(A) ; port RSTINn
RSTINn_BUFF: R59.1 U8.4(Y) U10.1(A)
RSTOUTn: R144.2 U11.4(Y) ; port RSTOUTn
RSTOUTn_BUFF: R51.2 R70.2 U11.1(A) U11.2(B)
RSTOUTn_R: R49.1 R51.1 U1.H19(<EIM_ADDR25>_/_ECSPI4_SS1_/_ECSPI2_RDY_/_IPU1_DI1_PIN12_/_IPU1_DI0_D1_CS_/_GPIO5_IO02_/_HDMI_TX_CEC_LINE)
RTC_XTALI: C211.1 R168.1 U1.D9(XTALOSC_RTC_XTALI) Y2.1
RTC_XTALO: C212.1 R168.2 U1.C9(XTALOSC_RTC_XTALO) Y2.2
SENSE_1V5: R302.1 R303.2 U31.5(SENSE1)
TAMPER: R55.1 U1.E11(SNVS_TAMPER)
TEST_MODE: R56.2 U1.E12(TCU_TEST_MODE)
USER_LED: U1.E19(SD1_DATA2_/_ECSPI5_SS1_/_GPT_COMPARE2_/_PWM2_OUT_/_WDOG1_B_/_<GPIO1_IO19>_/_WDOG1_RESET_B_DEB) ; port USER_LED
VID_IN_CSI1_RSTn: R178.1 R179.1 ; port VID_IN_CSI1_RSTn
VID_IN_CSI1_RSTn_R: R179.2 ; port VID_IN_CSI1_RSTn_R
WD_OUT: R271.1 U1.T2(ESAI_RX_FS_/_WDOG1_B_/_KEY_COL6_/_CCM_REF_EN_B_/_PWM1_OUT_/_<GPIO1_IO09>_/_SD1_WP)

Not connected (* = marked no-connect by the designer): U1 C5(XTALOSC_CLK2_N)* D5(XTALOSC_CLK2_P)* V24(IPU1_DISP0_DATA22_/_IPU2_DISP0_DATA22_/_ECSPI1_MISO_/_AUD4_TXFS_/_<GPIO5_IO16>)* W23(USB_OTG_ID_/_ENET_RX_ER_/_ESAI_RX_HF_CLK_/_SPDIF_IN_/_ENET_1588_EVENT2_OUT_/_<GPIO1_IO24>)*

### Layout directives
net class JTAG: JTAG_MOD, JTAG_nTRST, JTAG_TCK, JTAG_TCK_R, JTAG_TDI, JTAG_TDI_R, JTAG_TDO, JTAG_TDO_R, JTAG_TMS

### Notes on the sheet
- CPU - JTAG, CONTROL
- CONTROL
- DESIGN NOTE:
  PMIC_STBY_REQ_CPU enters and exits PMIC standby:
  0->1 = enter standby
  1->0 = wake-up from standby
- DESIGN NOTE:
  User LED can be controlled using PWM output.
- DESIGN NOTE:
  PMIC_ON_REQ:
  1 or high Z  = ON
  0 = OFF
- DESIGN NOTE:
  WD_OUT configure in software first.
- DESIGN NOTE:
  Board variant pins can be used to detect a specific HW version of the iMX6 OpenRex board.
- DESIGN NOTE:
  BOARD_ID_1 signal is used to detect the board. This way a generic software can identify the board and load a specific configuration.
  Board ID configuration:
  Rex        TinyRex     OpenRex
  - GPIO5_IO16:         1                0                  1
  - GPIO5_IO17:         1                1                  0
  - GPIO1_IO24:         1                1                  1
- DESIGN NOTE:
  Resistor R20 from CPU_XTALI to GND is required to correct a known 24MHz slow starting issue present on some i.MX6 part. Please refer to the i.MX6 Processor Errata, issue # ERR005777 for more details.
- DESIGN NOTE:
  Default boot mode: 00 (eFuses).
  BOOT MODE [1:0]:
  00 Boot from fuses
  01 Serial downloader
  10 Boot from board settings
  11 Reserved
- DESIGN NOTE:
  Tamper will not be used.
- RESET
- DESIGN NOTE:
  RSTOUTn, VID_IN_CSI1_RSTn and PCIE_RSTn:
  ALWAYS FIT ONLY ONE OF THE 0R Resistors (e.g. R51 or R70, R179 or R178, R170 or R158). Wrong configuration may prevent your board from booting. If manual reset is use, be sure you setup these pins correctly in software.
- DESIGN NOTE:
  Test mode only for factory use.
  From Design Guide: TEST_MODE pull down internally - externall not required
- (near U31) DESIGN NOTE:
  Be careful, some pins are connected to 3.0V ALWAYS
- DESIGN NOTE:
  Leave open to boot from eFuses, short to boot from USB OTG.
- DESIGN NOTE:
  JP2 default:
  Unfit Link to boot from eFuses
- DESIGN NOTE:
  RSTOUTn is setup as a Low Output signal after reset. Software support is required.
- JTAG
- Reset Threhold 0.84 Volts
- DESIGN NOTE:
  from Design Guide: JTAG_MOD use pulldown 1k or tie to GND
- (near U10) DESIGN NOTE:
  CT 100nF = 0.6s RESET Delay
- DESIGN NOTE:
  From Design Guide:
  Do not use external PU/PD on JTAG_TDO.
- DESIGN NOTE:
  MR (signal POK_SYS) pin of voltage monitor has an internal pullup resistor connected to +3V0_ALWAYS.
- DESIGN NOTE:
  Fit R177 and do not fit R333 when +3V3 optional source is not used.
  POK_1V375_OPT is designed to tie low the POK_SYS if voltage from optional source is not valid. R351 does not depend on the resistors R177 or R333.
- DESIGN NOTE:
  If testing shows that reset controller U31 is not required, it can be bypassed with R350.
- FREE for personal and commercial use. See the license.
- DESIGN NOTE:
  When RGMII_RSTn is controlled by GPIO and also by POR (D1 and R166 both fitted), setup RGMII_RSTn_R as an open drain signal. If it is not used as open drain, it can prevent CPU from booting.
- Variant:
- Checked by
- (near *#11) DESIGN NOTE:
  If RSTOUTn, VID_IN_CSI1_RSTn, PCIE_RSTn and RGMII_RSTn are controlled by processor GPIOs, do not forget to support them in software first. They can be connected to the POR (while disconnected them from GPIOs) to reset peripherals. Set them as an open drain by default.
  BE AWARE!
  RGMII_RSTn_R is HIGH after reset.
- Designed by www.fedevel.com
- (in symbol 2N7002BKW,115) D; G; S
- (in symbol MCIMX6Q5EYM10AC_v.ORX, part A) i.MX6Q - CONTROL
- (in symbol SDTitleBlock) Title:; Page Contents:; Revision:; Size:; DWG NO; Date:; Sheet; of
- (in symbol SN74AHC1G09DCKR) AND
- (in symbol SN74LVC1G08DCKR) AND

### Library data of the parts
C83 C84 = C1005C0G1H180J: CAP CER 18PF 50V C0G 5% 0402; Manufacturer: TDK Corporation; .Checked PCB: used; Temperature Coefficient: C0G, NP0; Capacitance: 18pF; Category: Capacitors; Supplier Part Number: 445-1238-1-ND; Manufacturer Part Number: C1005C0G1H180J; Operating Temperature: -55°C ~ 125°C; Package / Case: 0402 (1005 Metric); Price 1k [$]: 0.00468; Value: 18pF; .Checked SCH: used; Voltage - Rated: 50V; Supplier: Digikey; Supplier 1: Digi-Key; Supplier Part Number 1: 445-1238-1-ND; RoHS: RoHS Compliant; Stock 1: 24321; Pricing 1: 1=0.08, 10=0.05, 100=0.018, 250=0.013, 500=0.0096, 1000=0.0065 (USD); Tolerance: ±5%; Mounting Type: Surface Mount, MLCC; Applications: General Purpose; Ratings: -; Size / Dimension: 0.039" L x 0.020" W (1.00mm x 0.50mm); Height - Seated (Max): -; Thickness (Max): 0.022" (0.55mm); Lead Spacing: -; Features: -; Packaging: Cut Tape (CT); Lead Style: -; ComponentLink1URL: http://www.tdk.co.jp/tefe02/e412_c.pdf; ComponentLink1Description: http://www.tdk.co.jp/tefe02/e412_c.pdf
C87 C89 C386 C412 C413 = C1005X5R1H104K: CAP CER .10UF 50V X5R 10% 0402; Manufacturer: TDK Corporation; Capacitance: 0.1µF; Value: 100nF; .Checked PCB: used; Category: Capacitors; Manufacturer Part Number: C1005X5R1H104K; Operating Temperature: -55°C ~ 85°C; Package / Case: 0402 (1005 Metric); Price 1k [$]: 0.02340; .Checked SCH: used; Voltage - Rated: 50V; Supplier Part Number: 445-5942-1-ND; Supplier: Digikey; Supplier 1: Digi-Key; Supplier Part Number 1: 445-5942-1-ND; RoHS: RoHS Compliant; Stock 1: 106926; Pricing 1: 1=0.27, 10=0.18, 100=0.072, 250=0.05176, 500=0.0369, 1000=0.027 (USD); Tolerance: ±10%; Temperature Coefficient: X5R; Mounting Type: Surface Mount, MLCC; Applications: General Purpose; Ratings: -; Size / Dimension: 0.039" L x 0.020" W (1.00mm x 0.50mm); Height - Seated (Max): -; Thickness (Max): 0.022" (0.55mm); Lead Spacing: -; Features: -; Packaging: Cut Tape (CT); Lead Style: -; ComponentLink1URL: http://www.tdk.co.jp/tefe02/e412_c.pdf; ComponentLink1Description: http://www.tdk.co.jp/tefe02/e412_c.pdf
C211 C212 = C0603C0G1H180J030BA: CAP CER 18PF 50V 5% C0G 0201; Manufacturer: TDK Corporation; Temperature Coefficient: C0G, NP0; .Creator: MM; Supplier 1: Digi-Key; Manufacturer Part Number: C0603C0G1H180J030BA; RoHS: RoHS Compliant; Category: Capacitors; Stock 1: 230156; Pricing 1: 1=0.1, 10=0.024, 100=0.011, 250=0.009, 500=0.0077, 1000=0.006, 5000=0.005 (USD); Packaging: Cut Tape (CT); Capacitance: 18pF; Tolerance: ±5%; Voltage - Rated: 50V; Mounting Type: Surface Mount, MLCC; Operating Temperature: -55°C ~ 125°C; Applications: General Purpose; Ratings: -; Package / Case: 0201 (0603 Metric); Size / Dimension: 0.024" L x 0.012" W (0.60mm x 0.30mm); Height - Seated (Max): -; Thickness (Max): 0.013" (0.33mm); Lead Spacing: -; Features: -; Lead Style: -; ComponentLink1URL: http://product.tdk.com/en/catalog/datasheets/mlcc_commercial_general_en.pdf; ComponentLink1Description: http://product.tdk.com/en/catalog/datasheets/mlcc_commercial_general_en.pdf; Supplier Part Number 1: 445-1777-1-ND; .Checked PCB: MM; .Checked SCH: MM
D10 D28 D29 = RB751V-40-TP: DIODE SCHTKY 30MA 30V SOD-323; Manufacturer: Micro Commercial Co; Diode Type: Schottky; Voltage - Forward (Vf) (Max) @ If: 370mV @ 1mA; Speed: Small Signal =< 200mA (Io), Any Speed; Current - Reverse Leakage @ Vr: 500nA @ 30V; Capacitance @ Vr, F: 2pF @ 1V, 1MHz; .Checked PCB: used; Supplier 1: Digi-Key; Supplier Part Number 1: RB751V-40-TPMSCT-ND; Manufacturer Part Number: RB751V-40-TP; RoHS: RoHS Compliant; Category: Discrete Semiconductor Products; Stock 1: 18964; Pricing 1: 1=0.48, 10=0.342, 100=0.2014, 250=0.14252, 500=0.1216, 1000=0.095 (USD); Voltage - DC Reverse (Vr) (Max): 30V; Current - Average Rectified (Io): 30mA; Reverse Recovery Time (trr): -; Mounting Type: Surface Mount; Package / Case: SC-76, SOD-323; Supplier Device Package: SOD-323; Packaging: Cut Tape (CT); ComponentLink1URL: http://61.222.192.61/mccsemi/up_pdf/RB751V-40(SOD-323).PDF; ComponentLink1Description: http://61.222.192.61/mccsemi/up_pdf/RB751V-40(SOD-323).PDF; .Checked SCH: used
JP2 = 68001-202HLF: BERGSTIK II .100" SR STRAIGHT; Manufacturer: FCI; Connector Type: Header, Unshrouded; Number of Positions: 2; Number of Positions Loaded: All; Pitch: 0.100" (2.54mm); .Checked PCB: used; Supplier 1: Digi-Key; Supplier Part Number 1: 609-3469-ND; Manufacturer Part Number: 68001-202HLF; RoHS: RoHS Compliant; Category: Connectors, Interconnects; Stock 1: 13680; Pricing 1: 1=0.45, 10=0.265, 100=0.1172, 250=0.09828, 500=0.09072, 1000=0.07938, 5000=0.05065 (USD); Contact Type: Male Pin; Number of Rows: 1; Row Spacing: -; Contact Mating Length: 0.230" (5.84mm); Mounting Type: Through Hole; Termination: Solder; Fastening Type: -; Features: -; Contact Finish: Gold; Contact Finish Thickness: 15µin (0.38µm); Color: Black; Packaging: Bulk; ComponentLink1URL: http://portal.fciconnect.com/res/en/pdffiles/doc_search/68000.pdf; ComponentLink1Description: http://portal.fciconnect.com/res/en/pdffiles/doc_search/68000.pdf; .Checked SCH: used
LINK2 = QPC02SXGN-RC: CONN JUMPER SHORTING .100" GOLD; Manufacturer: Sullins Connector Solutions; Gender: Female Sockets; Number of Positions or Pins (Grid): 2 (1 x 2); Pitch: 0.100" (2.54mm); .Checked SCH: used; Supplier 1: Digi-Key; Supplier Part Number 1: S9337-ND; Manufacturer Part Number: QPC02SXGN-RC; RoHS: RoHS Compliant; Category: Connectors, Interconnects; Stock 1: 23274; Pricing 1: 1=0.11, 10=0.066, 25=0.0468, 50=0.0384, 100=0.033, 250=0.02792, 500=0.0258, 1000=0.0228, 2500=0.018 (USD); Type: Open Top; Height: 0.235" (5.97mm); Contact Finish: Gold; Contact Finish Thickness: Flash; Color: -; Packaging: Bulk; ComponentLink1URL: http://www.sullinscorp.com/drawings/284_SXGN_11510.pdf; ComponentLink1Description: http://www.sullinscorp.com/drawings/284_SXGN_11510.pdf
Q9 = 2N7002BKW,115: MOSFET N-CH 60V 310MA SOT323; Manufacturer: NXP Semiconductors; FET Type: MOSFET N-Channel, Metal Oxide; FET Feature: Logic Level Gate; Rds On (Max) @ Id, Vgs: 1.6 Ohm @ 500mA, 10V; Vgs(th) (Max) @ Id: 2.1V @ 250µA; Gate Charge (Qg) @ Vgs: 0.6nC @ 4.5V; Input Capacitance (Ciss) @ Vds: 50pF @ 10V; Power - Max: 275mW; .Checked PCB: used; Supplier 1: Digi-Key; Supplier Part Number 1: 568-5980-1-ND; Manufacturer Part Number: 2N7002BKW,115; RoHS: RoHS Compliant; Category: Discrete Semiconductor Products; Stock 1: 15666; Pricing 1: 1=0.39, 10=0.354, 25=0.2548, 100=0.1983, 250=0.12456, 500=0.10616, 1000=0.07233 (USD); Drain to Source Voltage (Vdss): 60V; Current - Continuous Drain (Id) @ 25° C: 310mA; Mounting Type: Surface Mount; Package / Case: SC-70, SOT-323; Supplier Device Package: SC-70; Packaging: Cut Tape (CT); ComponentLink1URL: http://www.nxp.com/documents/data_sheet/2N7002BKW.pdf; ComponentLink1Description: http://www.nxp.com/documents/data_sheet/2N7002BKW.pdf; .Checked SCH: used
R15 R48 R49 R57-R59 R62-R64 R68 R69 R144 R159 R163 R164 R166 R173 R175 R225 R272 R303 = RC0402FR-0710KL: as R212 on sheet [10] - CPU - GPIO, PWM, LEDS, BUTTONS; Category: Resistors; Supplier Part Number: 311-10.0KLRCT-ND; Manufacturer Part Number: RC0402FR-0710KL; Package / Case: 0402 (1005 Metric); Price 1k [$]: 0.01421; Resistance (Ohms): 10K; Tolerance: ±1%; Value: 10k; .Checked SCH: used; Supplier: Digikey; Supplier 1: Digi-Key; Supplier Part Number 1: 311-10.0KLRCT-ND; RoHS: RoHS Compliant; Stock 1: 2916495; Pricing 1: 10=0.014, 50=0.0104, 100=0.0079, 250=0.00584, 500=0.00432, 1000=0.00288 (USD); Composition: Thick Film; Features: -; Size / Dimension: 0.039" L x 0.020" W (1.00mm x 0.50mm); Height: 0.016" (0.40mm); Number of Terminations: 2; Packaging: Cut Tape (CT); ComponentLink1URL: http://www.yageo.com/documents/recent/PYu-RC0402_51_RoHS_L_6.pdf; ComponentLink1Description: http://www.yageo.com/documents/recent/PYu-RC0402_51_RoHS_L_6.pdf
R20 = CRCW04022M20FKED: RES 2.20M OHM 1/16W 1% 0402 SMD; Manufacturer: Vishay Dale; Resistance (Ohms): 2.2M; Power (Watts): 0.063W, 1/16W; Temperature Coefficient: ±100ppm/°C; .Creator: MM; .Checked PCB: used; Supplier 1: Digi-Key; Manufacturer Part Number: CRCW04022M20FKED; RoHS: RoHS Compliant; Category: Resistors; Stock 1: 77953; Pricing 1: 10=0.083, 50=0.0444, 200=0.0255, 1000=0.0174 (USD); Composition: Thick Film; Features: Automotive AEC-Q200 Qualified; Tolerance: ±1%; Package / Case: 0402 (1005 Metric); Supplier Device Package: 0402 (1005 Metric); Size / Dimension: 0.039" L x 0.020" W (1.00mm x 0.50mm); Height: 0.016" (0.40mm); Number of Terminations: 2; Packaging: Cut Tape (CT); ComponentLink1URL: http://www.vishay.com/doc?20035; ComponentLink1Description: http://www.vishay.com/doc?20035; Supplier Part Number 1: 541-2.20MLCT-ND; .Checked SCH: used
R51 R70 R93 R158 R170 R177-R180 R271 R333 R350 R351 = RC0402JR-070RL: RES 0.0 OHM 1/16W 0402 SMD; Manufacturer: Yageo; Resistance (Ohms): 0.0; Power (Watts): 0.063W, 1/16W; Tolerance: Jumper; .Checked PCB: used; Category: Resistors; Supplier Part Number: 311-0.0JRCT-ND; Manufacturer Part Number: RC0402JR-070RL; Package / Case: 0402 (1005 Metric); Price 1k [$]: 0.01389; Value: 0R; .Checked SCH: used; Supplier: Digikey; Supplier 1: Digi-Key; Supplier Part Number 1: 311-0.0JRCT-ND; RoHS: RoHS Compliant; Stock 1: 1106330; Pricing 1: 10=0.012, 50=0.009, 100=0.0069, 250=0.00512, 500=0.0038, 1000=0.00253 (USD); Composition: Thick Film; Features: -; Temperature Coefficient: -; Size / Dimension: 0.039" L x 0.020" W (1.00mm x 0.50mm); Height: 0.016" (0.40mm); Number of Terminations: 2; Packaging: Cut Tape (CT); ComponentLink1URL: http://www.yageo.com/documents/recent/PYu-RC0402_51_RoHS_L_6.pdf; ComponentLink1Description: http://www.yageo.com/documents/recent/PYu-RC0402_51_RoHS_L_6.pdf
R55 R56 = RMCF0201FT4K99: RES 4.99K OHM 1/20W 1% 0201; Manufacturer: Stackpole Electronics Inc; Power (Watts): 0.05W, 1/20W; Temperature Coefficient: ±200ppm/°C; .Creator: MM; Supplier 1: Digi-Key; Manufacturer Part Number: RMCF0201FT4K99; RoHS: RoHS Compliant; Category: Resistors; Stock 1: 28120; Pricing 1: 1=0.11, 10=0.074, 50=0.0402, 100=0.0306, 250=0.02276, 500=0.0168, 1000=0.0112, 2500=0.00945, 5000=0.00788 (USD); Packaging: Cut Tape (CT); Resistance (Ohms): 4.99k; Tolerance: ±1%; Composition: Thick Film; Features: -; Package / Case: 0201 (0603 Metric); Supplier Device Package: 0201; Size / Dimension: 0.024" L x 0.012" W (0.60mm x 0.30mm); Height: 0.009" (0.24mm); Number of Terminations: 2; ComponentLink1URL: http://www.seielect.com/Catalog/SEI-RMCF_RMCP.pdf; ComponentLink1Description: http://www.seielect.com/Catalog/SEI-RMCF_RMCP.pdf; Supplier Part Number 1: RMCF0201FT4K99CT-ND; .Checked PCB: MM; .Checked SCH: MM
R61 = RC0201FR-071KL: RES 1K OHM 1/20W 1% 0201 SMD; Manufacturer: Yageo; Power (Watts): 0.05W, 1/20W; Temperature Coefficient: ±200ppm/°C; .Creator: MM; Supplier 1: Digi-Key; Manufacturer Part Number: RC0201FR-071KL; RoHS: RoHS Compliant; Category: Resistors; Stock 1: 0; Pricing 1: 1=0.1, 10=0.074, 25=0.054, 100=0.0303, 250=0.02312, 500=0.0185, 1000=0.01361, 2500=0.01182, 5000=0.00976 (USD); Packaging: Cut Tape (CT); Resistance (Ohms): 1k; Tolerance: ±1%; Composition: Thick Film; Features: Moisture Resistant; Package / Case: 0201 (0603 Metric); Supplier Device Package: 0201; Size / Dimension: 0.024" L x 0.012" W (0.60mm x 0.30mm); Height: 0.010" (0.26mm); Number of Terminations: 2; ComponentLink1URL: http://www.yageo.com/documents/recent/PYu-RC0201_51_RoHS_L_8.pdf; ComponentLink1Description: http://www.yageo.com/documents/recent/PYu-RC0201_51_RoHS_L_8.pdf; Supplier Part Number 1: 311-1KMCT-ND; .Checked PCB: MM; .Checked SCH: MM
R73 R266 = RMCF0402FT100K: RES 100K OHM 1/16W 1% 0402 SMD; Manufacturer: Stackpole Electronics Inc; Power (Watts): 0.063W, 1/16W; .Checked PCB: used; Temperature Coefficient: ±100ppm/°C; Category: Resistors; Supplier Part Number: RMCF0402FT100KCT-ND; Manufacturer Part Number: RMCF0402FT100K; Package / Case: 0402 (1005 Metric); Price 1k [$]: 0.00384; Resistance (Ohms): 100K; Tolerance: ±1%; Value: 100k; .Checked SCH: used; Supplier: Digikey; Supplier 1: Digi-Key; Supplier Part Number 1: RMCF0402FT100KCT-ND; RoHS: RoHS Compliant; Stock 1: 95; Pricing 1: 1=0.04, 10=0.025, 50=0.0138, 100=0.0105, 250=0.0078, 500=0.00576, 1000=0.00384 (USD); Composition: Thick Film; Features: -; Size / Dimension: 0.039" L x 0.020" W (1.00mm x 0.50mm); Height: 0.016" (0.40mm); Number of Terminations: 2; Packaging: Cut Tape (CT); ComponentLink1URL: http://www.seielect.com/Catalog/SEI-RMCF.pdf; ComponentLink1Description: http://www.seielect.com/Catalog/SEI-RMCF.pdf
R90 R92 R161 = RC0402FR-0722RL: as R124 on sheet [09] - CPU - SD, AUDIO, I2C, CAN; Category: Resistors; Supplier Part Number: 311-22.0LRCT-ND; Manufacturer Part Number: RC0402FR-0722RL; Package / Case: 0402 (1005 Metric); Price 1k [$]: 0.01421; Tolerance: ±1%; Value: 22R; .Checked SCH: used; Supplier: Digikey; Supplier 1: Digi-Key; Supplier Part Number 1: 311-22.0LRCT-ND; RoHS: RoHS Compliant; Stock 1: 943800; Pricing 1: 10=0.014, 50=0.0104, 100=0.0079, 250=0.00584, 500=0.00432, 1000=0.00288 (USD); Composition: Thick Film; Features: -; Size / Dimension: 0.039" L x 0.020" W (1.00mm x 0.50mm); Height: 0.016" (0.40mm); Number of Terminations: 2; Packaging: Cut Tape (CT); ComponentLink1URL: http://www.yageo.com/documents/recent/PYu-RC0402_51_RoHS_L_6.pdf; ComponentLink1Description: http://www.yageo.com/documents/recent/PYu-RC0402_51_RoHS_L_6.pdf
R167 = CRCW040210M0FKED: RES 10.0M OHM 1/16W 1% 0402 SMD; Manufacturer: Vishay Dale; Power (Watts): 0.063W, 1/16W; Temperature Coefficient: ±100ppm/°C; .Checked PCB: RF; Supplier 1: Digi-Key; Supplier Part Number 1: 541-10.0MLCT-ND; Manufacturer Part Number: CRCW040210M0FKED; RoHS: RoHS Compliant; Category: Resistors; Stock 1: 182279; Pricing 1: 10=0.083, 50=0.0444, 200=0.0255, 1000=0.0174 (USD); Resistance (Ohms): 10M; Composition: Thick Film; Features: -; Tolerance: ±1%; Package / Case: 0402 (1005 Metric); Size / Dimension: 0.039" L x 0.020" W (1.00mm x 0.50mm); Height: 0.016" (0.40mm); Number of Terminations: 2; Packaging: Cut Tape (CT); ComponentLink1URL: http://www.vishay.com/doc?20035; ComponentLink1Description: http://www.vishay.com/doc?20035; .Checked SCH: RF
R168 = MCR006YZPF1005: RES 10M OHM 1/20W 1% 0201 SMD; Manufacturer: Rohm Semiconductor; Power (Watts): 0.05W, 1/20W; Temperature Coefficient: ±250ppm/°C; .Creator: MM; Supplier 1: Digi-Key; Manufacturer Part Number: MCR006YZPF1005; RoHS: RoHS Compliant; Category: Resistors; Stock 1: 88250; Pricing 1: 1=0.1, 10=0.064, 25=0.0464, 100=0.026, 250=0.0198, 500=0.01584, 1000=0.01166, 5000=0.00836 (USD); Packaging: Cut Tape (CT); Resistance (Ohms): 10M; Tolerance: ±1%; Composition: Thick Film; Features: Automotive AEC-Q200 Qualified; Package / Case: 0201 (0603 Metric); Supplier Device Package: 0201 (0603 Metric); Size / Dimension: 0.024" L x 0.012" W (0.60mm x 0.30mm); Height: 0.010" (0.26mm); Number of Terminations: 2; ComponentLink1URL: http://rohmfs.rohm.com/en/products/databook/datasheet/passive/resistor/chip_resistor/mcr_a.pdf; ComponentLink1Description: http://rohmfs.rohm.com/en/products/databook/datasheet/passive/resistor/chip_resistor/mcr_a.pdf; Supplier Part Number 1: RHM10MABCT-ND; .Checked PCB: MM; .Checked SCH: MM
R171 R172 R302 = RMCF0402FT4K99: as R257 on sheet [10] - CPU - GPIO, PWM, LEDS, BUTTONS; Category: Resistors; Supplier Part Number: RMCF0402FT4K99CT-ND; Manufacturer Part Number: RMCF0402FT4K99; Package / Case: 0402 (1005 Metric); Price 1k [$]: 0.00384; Resistance (Ohms): 4.99K; Tolerance: ±1%; Value: 4k99; .Checked SCH: used; Supplier: Digikey; Supplier 1: Digi-Key; Supplier Part Number 1: RMCF0402FT4K99CT-ND; RoHS: RoHS Compliant; Stock 1: 48509; Pricing 1: 1=0.04, 10=0.025, 50=0.0138, 100=0.0105, 250=0.0078, 500=0.00576, 1000=0.00384 (USD); Composition: Thick Film; Features: -; Size / Dimension: 0.039" L x 0.020" W (1.00mm x 0.50mm); Height: 0.016" (0.40mm); Number of Terminations: 2; Packaging: Cut Tape (CT); ComponentLink1URL: http://www.seielect.com/Catalog/SEI-RMCF.pdf; ComponentLink1Description: http://www.seielect.com/Catalog/SEI-RMCF.pdf
R346 = RC0402FR-071KL: RES 1.00K OHM 1/16W 1% 0402 SMD; Manufacturer: Yageo; Power (Watts): 0.063W, 1/16W; .Checked PCB: used; Temperature Coefficient: ±100ppm/°C; Category: Resistors; Supplier Part Number: 311-1.00KLRCT-ND; Manufacturer Part Number: RC0402FR-071KL; Package / Case: 0402 (1005 Metric); Price 1k [$]: 0.01421; Resistance (Ohms): 1K; Tolerance: ±1%; Value: 1k; .Checked SCH: used; Supplier: Digikey; Supplier 1: Digi-Key; Supplier Part Number 1: 311-1.00KLRCT-ND; RoHS: RoHS Compliant; Stock 1: 1753477; Pricing 1: 10=0.014, 50=0.0104, 100=0.0079, 250=0.00584, 500=0.00432, 1000=0.00288 (USD); Composition: Thick Film; Features: -; Size / Dimension: 0.039" L x 0.020" W (1.00mm x 0.50mm); Height: 0.016" (0.40mm); Number of Terminations: 2; Packaging: Cut Tape (CT); ComponentLink1URL: http://www.yageo.com/documents/recent/PYu-RC0402_51_RoHS_L_6.pdf; ComponentLink1Description: http://www.yageo.com/documents/recent/PYu-RC0402_51_RoHS_L_6.pdf
TP1-TP3 TP5 TP12 TP13 = TP_25MILC: Test Point 25mil
U1 = MCIMX6Q5EYM10AC_v.ORX: as U1 on sheet [10] - CPU - GPIO, PWM, LEDS, BUTTONS; Supplier 1: Digi-Key; Manufacturer Part Number: MCIMX6Q5EYM10AC; RoHS: RoHS Compliant; Category: Integrated Circuits (ICs); Stock 1: 0; Pricing 1: 1=54.98, 10=51.922, 25=48.868, 100=30.5424 (USD); Program Memory Size: -; EEPROM Size: -; Data Converters: -; Operating Temperature: -20°C ~ 105°C; Package / Case: 624-FBGA, FCBGA; Packaging: Tray; ComponentLink1URL: http://cache.freescale.com/files/32bit/doc/data_sheet/IMX6DQCEC.pdf; ComponentLink1Description: http://cache.freescale.com/files/32bit/doc/data_sheet/IMX6DQCEC.pdf; Supplier Part Number 1: MCIMX6Q5EYM10AC-ND
U8 U10 = SN74AHC1G09DCKR: IC GATE AND 1CH 2-INP SC-70-5; Manufacturer: Texas Instruments; Logic Type: AND Gate; Number of Circuits: 1; Number of Inputs: 2; Voltage - Supply: 2 V ~ 5.5 V; Current - Quiescent (Max): 1µA; Current - Output High, Low: -, 8mA; Logic Level - Low: 0.5 V ~ 1.65 V; Logic Level - High: 1.5 V ~ 3.85 V; Max Propagation Delay @ V, Max CL: 7.5ns @ 5V, 50pF; .Creator: MM; .Checked PCB: RF, used by MM; Supplier 1: Digi-Key; Manufacturer Part Number: SN74AHC1G09DCKR; RoHS: RoHS Compliant; Category: Integrated Circuits (ICs); Stock 1: 2059; Pricing 1: 1=0.49, 10=0.345, 25=0.2836, 100=0.2265, 250=0.165, 500=0.134, 750=0.11351, 1000=0.103 (USD); Packaging: Cut Tape (CT); Features: Open Drain; Operating Temperature: -55°C ~ 125°C; Mounting Type: Surface Mount; Supplier Device Package: SC-70-5; Package / Case: 6-TSSOP (5 Lead), SC-88A, SOT-353; ComponentLink1URL: http://www.ti.com/lit/ds/symlink/sn74ahc1g09.pdf; ComponentLink1Description: http://www.ti.com/lit/ds/symlink/sn74ahc1g09.pdf; Supplier Part Number 1: 296-29203-1-ND; .Checked SCH: MM
U11 = SN74LVC1G08DCKR: SINGLE POSITIVE AND GATE SC-70; Manufacturer: Texas Instruments; .Checked PCB: used; Number of Inputs: 2; Voltage - Supply: 1.65 V ~ 5.5 V; Number of Circuits: 1; Current - Output High, Low: 32mA, 32mA; .Checked SCH: used; Category: Integrated Circuits (ICs); Supplier Part Number: 296-11602-1-ND; Family: Logic - Gates and Inverters; Manufacturer Part Number: SN74LVC1G08DCKR; Operating Temperature: -40°C ~ 85°C; Package / Case: 6-TSSOP (5 lead), SC-88A, SOT-353; Price 1k [$]: 0.11250; Value: SN74LVC1G08DCKR; Logic Type: AND Gate; Supplier: Digikey; Supplier 1: Digi-Key; Supplier Part Number 1: 296-11602-1-ND; RoHS: RoHS Compliant; Stock 1: 36212; Pricing 1: 1=0.7, 25=0.322, 100=0.224, 250=0.1596, 500=0.1218, 1000=0.084 (USD); Mounting Type: Surface Mount; Supplier Device Package: SC-70-5; Packaging: Cut Tape (CT); ComponentLink1URL: http://www.ti.com/lit/ds/symlink/sn74lvc1g08.pdf; ComponentLink1Description: http://www.ti.com/lit/ds/symlink/sn74lvc1g08.pdf
U31 = TPS3808G09DBVR: IC VOLT SUPERVISOR 0.9V SOT23-6; Part #: 102020-0009R; Manufacturer: Texas Instruments; .Checked PCB: used; Number of Voltages Monitored: 1; Output: Open Drain or Open Collector; Reset: Active Low; Reset Timeout: Adjustable/Selectable; Voltage - Threshold: 0.84V; .Checked SCH: used; Category: Integrated Circuits (ICs); Supplier Part Number: 296-17189-1-ND; Family: PMIC - Supervisors; Manufacturer Part Number: TPS3808G09DBVR; Operating Temperature: -40°C ~ 125°C; Package / Case: SOT-23-6; Price 1k [$]: 1.12000; Value: TPS3808G09DBVR; Type: Simple Reset/Power-On Reset; Supplier: Digikey; Supplier 1: Digi-Key; Supplier Part Number 1: 296-17189-1-ND; RoHS: RoHS Compliant; Stock 1: 61681; Pricing 1: 1=2.45, 25=1.89, 100=1.715, 250=1.54, 500=1.33, 1000=1.12 (USD); Mounting Type: Surface Mount; Supplier Device Package: SOT-23-6; Packaging: Cut Tape (CT); ComponentLink1URL: http://www.ti.com/lit/ds/symlink/tps3808g01.pdf; ComponentLink1Description: http://www.ti.com/lit/ds/symlink/tps3808g01.pdf
Y1 = ABM8-24.000MHZ-R60-D-1-W-T: CRYSTAL 24MHZ 18PF SMD; Manufacturer: Abracon Corporation; Frequency Stability: ±25ppm; Frequency Tolerance: ±10ppm; ESR (Equivalent Series Resistance): 50 Ohm; Operating Mode: Fundamental; .Creator: MM; Supplier 1: Digi-Key; Manufacturer Part Number: ABM8-24.000MHZ-R60-D-1-W-T; RoHS: RoHS Compliant; Category: Crystals and Oscillators; Stock 1: 11496; Pricing 1: 1=1.42, 10=1.356, 50=1.326, 100=1.134, 500=1.104 (USD); Packaging: Cut Tape (CT); Type: MHz Crystal; Frequency: 24MHz; Load Capacitance: 18pF; Operating Temperature: -40°C ~ 85°C; Ratings: -; Mounting Type: Surface Mount; Package / Case: 4-SMD, No Lead (DFN, LCC); Size / Dimension: 0.126" L x 0.098" W (3.20mm x 2.50mm); Height: 0.031" (0.80mm); ComponentLink1URL: http://www.abracon.com/Resonators/abm8.pdf; ComponentLink1Description: http://www.abracon.com/Resonators/abm8.pdf; Supplier Part Number 1: 535-10155-1-ND; .Checked PCB: MM; .Checked SCH: MM
Y2 = ABS06-32.768KHZ-9-1-T: CRYSTAL 32.768 KHZ 9.0 PF SMD; Manufacturer: Abracon Corporation; .Checked PCB: used; Frequency Stability: ±10ppm; Load Capacitance: 9pF; Operating Mode: Fundamental; .Checked SCH: used; Category: Crystals and Oscillators; Supplier Part Number: 535-10247-1-ND; Manufacturer Part Number: ABS06-32.768KHZ-9-1-T; Operating Temperature: -40°C ~ 85°C; Package / Case: 2-SMD, No Lead (DFN, LCC); Price 1k [$]: 1.24500; Value: 32.768kHz; Frequency: 32.768kHz; Supplier: Digikey; Supplier 1: Digi-Key; Supplier Part Number 1: 535-10247-1-ND; RoHS: RoHS Compliant; Stock 1: 5693; Pricing 1: 1=2.81, 10=2.438, 50=2.1376, 100=1.6875, 500=1.425 (USD); Type: kHz Crystal (Tuning Fork); Frequency Tolerance: ±10ppm; Mounting Type: Surface Mount; Size / Dimension: 0.079" L x 0.047" W (2.00mm x 1.20mm); Height: 0.024" (0.60mm); Packaging: Cut Tape (CT); ComponentLink1URL: http://www.abracon.com/Resonators/ABS06.pdf; ComponentLink1Description: http://www.abracon.com/Resonators/ABS06.pdf